# Altium project openmv-ae3.PrjPcb (part 1 of 2)
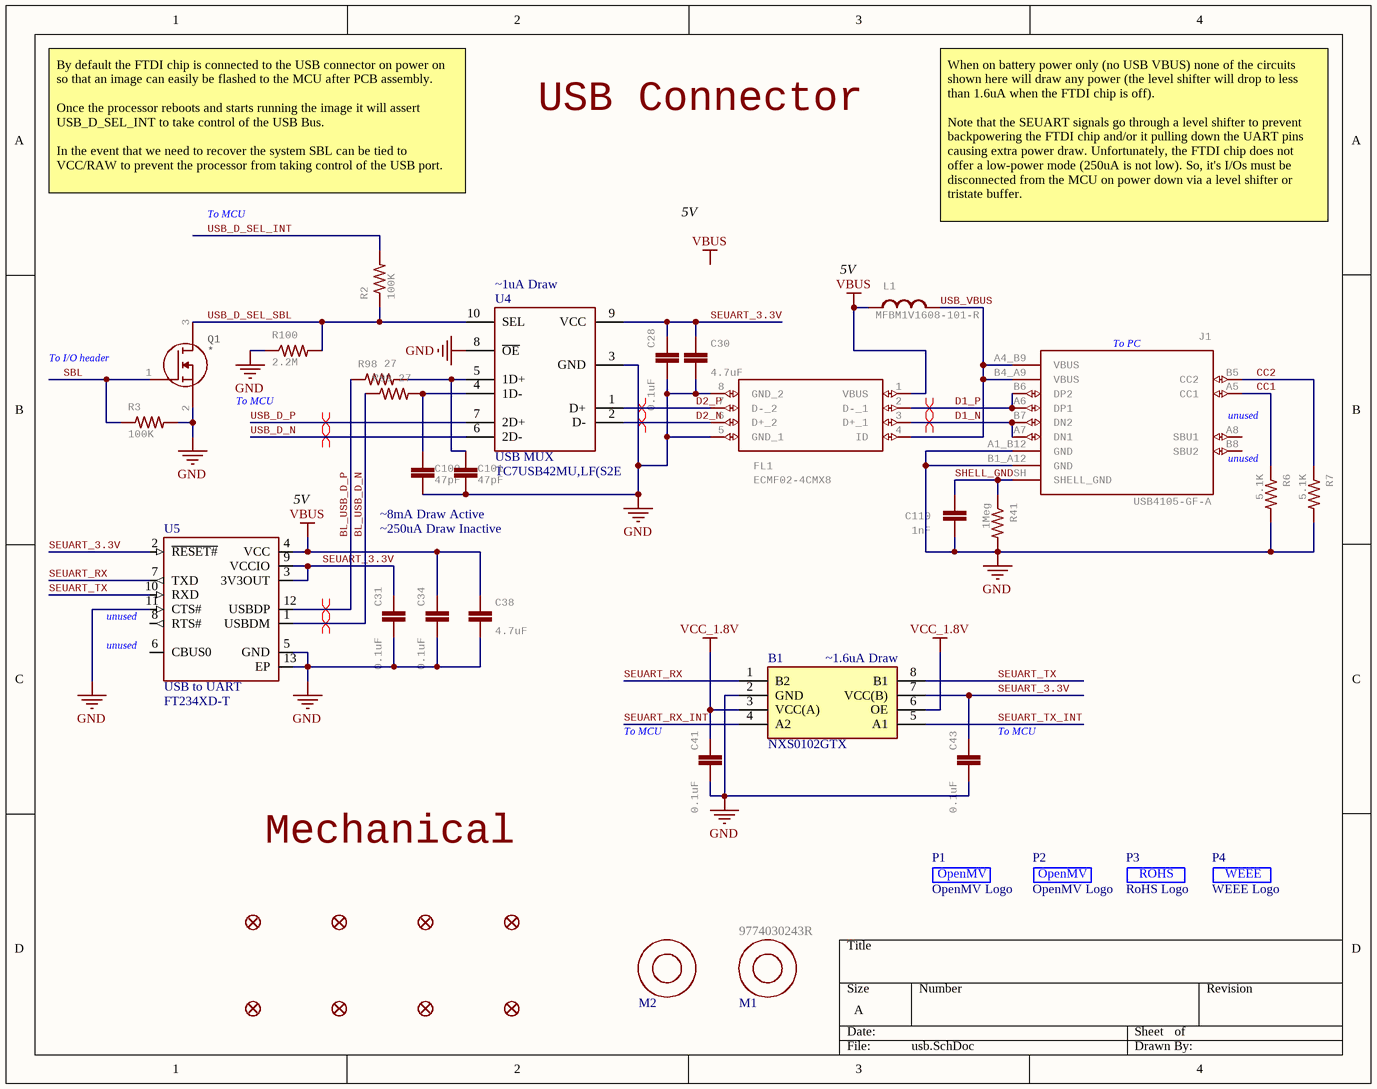
[diagram p0: usb.SchDoc]
16 sheets, 351 parts. Net scope: global (net labels, ports and power ports of the same name join across sheets).
Board file: openmv-ae3.PcbDoc
Sheets:
  usb.SchDoc
  ideal-diode.SchDoc
  battery-charging.SchDoc
  regulators.SchDoc
  prg-flash.SchDoc
  psram.SchDoc
  accelerometer.SchDoc
  sd-card.SchDoc
  sensor-header.SchDoc
  io-headers.SchDoc
  jtag.SchDoc
  display-header.SchDoc
  ethernet.SchDoc
  wifi-bt.SchDoc
  mic.SchDoc
  ae302f.SchDoc

## Sheet usb.SchDoc
size A

### Parts
B1  NXS0102GTX  [NXS0102GTX]
C28  0.1uF  [0402-CAP]
C30  4.7uF  [0402-CAP]
C31  0.1uF  [0402-CAP]
C34  0.1uF  [0402-CAP]
C38  4.7uF  [0402-CAP]
C41  0.1uF  [0402-CAP]
C43  0.1uF  [0402-CAP]
C100  47pF  [C0201]
C101  47pF  [C0201]
C110  1nF  [0402-CAP]
FD1  FIDUCIAL1X2  [FIDUCIAL-1X2]  (value not drawn)
FD2  FIDUCIAL1X2  [FIDUCIAL-1X2]  (value not drawn)
FD3  FIDUCIAL1X2  [FIDUCIAL-1X2]  (value not drawn)
FD4  FIDUCIAL1X2  [FIDUCIAL-1X2]  (value not drawn)
FD5  FIDUCIAL1X2  [FIDUCIAL-1X2]  (value not drawn)
FD6  FIDUCIAL1X2  [FIDUCIAL-1X2]  (value not drawn)
FD7  FIDUCIAL1X2  [FIDUCIAL-1X2]  (value not drawn)
FD8  FIDUCIAL1X2  [FIDUCIAL-1X2]  (value not drawn)
FL1  ECMF02-4CMX8  [ECMF024CMX8]
J1  USB4105-GF-A  [GCT_USB4105-GF-A]
L1  MFBM1V1608-101-R  [0603-RES]
M1  9774030243R  [9774030243R]
M2  9774030243R  [9774030243R]  (value not drawn)
P1  OpenMV Logo  [OMV-LOGO-SMALL]  (no BOM)
P2  OpenMV Logo  [OMV-LOGO-SMALL]  (no BOM)
P3  RoHS Logo  [ROHS]  (no BOM)
P4  WEEE Logo  [WEEE]  (no BOM)
Q1  NMOS  [DFN1006]  (value not drawn)
R2  100K  [R0201]
R3  100K  [R0201]
R6  5.1K  [0402-RES]
R7  5.1K  [0402-RES]
R41  1Meg  [0402-RES]
R98  27  [R0201]
R99  27  [R0201]
R100  2.2M  [R0201]
U4  USB MUX  [TC7USB42MU,LF(S2E]
U5  USB to UART  [SON45P300X300X80-13N]

### Nets
GND: B1.2(GND) C28.2 C30.1 C31.2 C34.2 C38.1 C41.2 C43.2 C100.1 C101.1 C110.2 FL1.5(GND_1) FL1.8(GND_2) J1.A1_B12(GND) J1.B1_A12(GND) Q1.2(S) R3.2 R6.2 R7.2 R41.2 R100.1 U4.3(GND) U4.8(~{OE}) U5.5(GND) U5.11(CTS#) U5.13(EP)
VBUS: C34.1 C38.2 FL1.1(VBUS) L1.1 U5.4(VCC)
VCC_1.8V: B1.3(VCC(A)) B1.6(OE) C41.1
BL_USB_D_N: R99.1 U5.1(USBDM)
BL_USB_D_P: R98.1 U5.12(USBDP)
CC1: J1.A5(CC1) R6.1
CC2: J1.B5(CC2) R7.1
D1_N: FL1.3(D+_1) J1.A7(DN1) J1.B7(DN2)
D1_P: FL1.2(D-_1) J1.A6(DP1) J1.B6(DP2)
D2_N: FL1.6(D+_2) U4.2(D-)
D2_P: FL1.7(D-_2) U4.1(D+)
SBL: Q1.1(G) R3.1
SEUART_3.3V: B1.7(VCC(B)) C28.1 C30.2 C31.1 C43.1 U4.9(VCC) U5.2(~{RESET#}) U5.3(3V3OUT) U5.9(VCCIO)
SEUART_RX: B1.1(B2) U5.7(TXD)
SEUART_RX_INT: B1.4(A2)
SEUART_TX: B1.8(B1) U5.10(RXD)
SEUART_TX_INT: B1.5(A1)
SHELL_GND: C110.1 J1.SH(SHELL_GND) R41.1
USB_D_N: U4.6(2D-)
USB_D_P: U4.7(2D+)
USB_D_SEL_INT: R2.2
USB_D_SEL_SBL: Q1.3(D) R2.1 R100.2 U4.10(SEL)
USB_VBUS: FL1.4(ID) J1.A4_B9(VBUS) J1.B4_A9(VBUS) L1.2
NetC100_2: C100.2 R99.2 U4.4(1D-)
NetC101_2: C101.2 R98.2 U4.5(1D+)

Not connected (* = marked no-connect by the designer): J1 A8(SBU1) B8(SBU2); U5 6(CBUS0) 8(RTS#)

### Layout directives
differential pair: BL_USB_D_N, BL_USB_D_P, D1_N, D1_P, D2_N, D2_P, USB_D_N, USB_D_P

### Notes on the sheet
- USB Connector
- By default the FTDI chip is connected to the USB connector on power on so that an image can easily be flashed to the MCU after PCB assembly.
  Once the processor reboots and starts running the image it will assert USB_D_SEL_INT to take control of the USB Bus.
  In the event that we need to recover the system SBL can be tied to VCC/RAW to prevent the processor from taking control of the USB port.
- To MCU
- 5V
- When on battery power only (no USB VBUS) none of the circuits shown here will draw any power (the level shifter will drop to less than 1.6uA when the FTDI chip is off).
  Note that the SEUART signals go through a level shifter to prevent backpowering the FTDI chip and/or it pulling down the UART pins causing extra power draw. Unfortunately, the FTDI chip does not offer a low-power mode (250uA is not low). So, it's I/Os must be disconnected from the MCU on power down via a level shifter or tristate buffer.
- (near U4) ~1uA Draw
- (near L1) 5V
- To I/O header
- (near J1) To PC
- unused
- (near J1) unused
- (near U5) 5V
- ~250uA Draw Inactive
- ~8mA Draw Active
- (near U5) unused
- (near B1) ~1.6uA Draw
- (near C41) To MCU
- (near C43) To MCU
- Mechanical
- Labels drawn without touching a wire or pin: VBUS
- (in symbol OMV) OpenMV

### Library data of the parts
B1 = NXS0102GTX: Dual supply translating transceiver; open drain; auto direction sensing; Manufacturer_Name: Nexperia; Geometry.Height: 0.5mm; Mouser Part Number: 771-NXS0102GTX; Mouser Price/Stock: https://www.mouser.co.uk/ProductDetail/Nexperia/NXS0102GTX?qs=GBLSl2AkirukzzJX55VgJA%3D%3D; Manufacturer_Part_Number: NXS0102GTX; Datasheet Link: https://assets.nexperia.com/documents/data-sheet/NXS0102.pdf
C28 C31 C34 C41 C43 = C-EUC0201: CAPACITOR, European symbol; MPN: C0402C104Z4VAC; GateName_1: G$1; SymbolName_1: C-EU; POPULARITY: 0; LibraryName: rcl; DeviceSetName: C-EU; SPICEPREFIX: C; Part Number: C0402C104Z4VAC
C30 C38 = CAP0402-CAP: CapacitorStandard 0603 ceramic capacitor, and 0.1" leaded capacitor.; MPN: JMK105BBJ475MV-F; GateName_1: G$1; SymbolName_1: CAP; DeviceName: 0402-CAP; LibraryName: sfe; DeviceSetName: CAP; Part Number: JMK105BBJ475MV-F
C100 C101 = C-EUC0201: CAPACITOR, European symbol; GateName_1: G$1; SymbolName_1: C-EU; POPULARITY: 0; DeviceName: C0201; SPICEPREFIX: C
C110 = CAP0402-CAP: Capacitor; MPN: VJ0402Y102JXACW1BC; GateName_1: G$1; SymbolName_1: CAP; DeviceName: 0402-CAP; LibraryName: sfe; DeviceSetName: CAP; Part Number: VJ0402Y102JXACW1BC
FD1-FD8 = FIDUCIAL1X2: Fiducial Alignment Points    Point-of-reference for pick-and-place machines and other optical instruments.; GateName_1: G$1; DeviceName: 1X2; SymbolName_1: FIDUCIAL; LibraryName: SparkFun-Aesthetics; DeviceSetName: FIDUCIAL
FL1 = ECMF02-4CMX8: Common Mode Filter & ESD Prot. USB uQFN8 STMicroelectronics ECMF02 Series, Signal Filter uQFN SMD, Flat Contact Termination, 2.6 x 1.3 x 0.6mm   Source:  Datasheet; GateName_1: G$1; SymbolName_1: ECMF02-4CMX8; LibraryName: ECMF02-4CMX8; DeviceSetName: ECMF02-4CMX8; HEIGHT: mm; MANUFACTURER_NAME: STMicroelectronics; MANUFACTURER_PART_NUMBER: ECMF02-4CMX8; MOUSER_PART_NUMBER: 511-ECMF02-4CMX8; MOUSER_PRICE-STOCK: https://www.mouser.co.uk/ProductDetail/STMicroelectronics/ECMF02-4CMX8?qs=xYt8xtm2zhmK7GoDlDZR3A%3D%3D; MPN: ECMF02-4CMX8; Part Number: ECMF02-4CMX8
J1 = USB4105-GF-A: USB-C (USB TYPE-C) USB 2.0 Receptacle Connector 24 (16+8 Dummy) Position Surface Mount, Right Angle; Through Hole  Check availability; GateName_1: G$1; MF: GCT; SymbolName_1: USB4105-GF-A; LibraryName: USB4105-GF-A; DeviceSetName: USB4105-GF-A; AVAILABILITY: In Stock; MP: USB4105-GF-A; MPN: USB4105-GF-A; PACKAGE: None; PRICE: None; PURCHASE-URL: https://pricing.snapeda.com/search/part/USB4105-GF-A/?ref=eda; Part Number: USB4105-GF-A
L1 = INDUCTOR: InductorsBasic Inductor/Choke - 0603 and 1206. Footprints are not proven and vary greatly between part numbers.; GateName_1: G$1; MPN: MFBM1V1608-101-R; Part Number: MFBM1V1608-101-R
M1 M2 = 9774030243R: M2 3mm Standoff; GateName_1: G$1; SymbolName_1: 9774030243R; LibraryName: 9774030243R; DeviceSetName: 9774030243R; MPN: 9774030243R; Part Number: 9774030243R
P1 P2 = OMV
P3 = ROHS
P4 = WEEE
R2 R3 R98-R100 = RESISTOR0402-RES: GateName_1: G$1; SymbolName_1: RESISTOR; LibraryName: sfe; DeviceSetName: RESISTOR
  R2 R3 R100: DeviceName: 0402-RES
R6 R7 = RESISTOR0402-RES: ResistorBasic schematic elements and footprints for 0603, 1206, and PTH resistors.; MPN: RC0402JR-075K1L; GateName_1: G$1; SymbolName_1: RESISTOR; DeviceName: 0402-RES; LibraryName: sfe; DeviceSetName: RESISTOR; Part Number: RC0402JR-075K1L
R41 = RESISTOR0402-RES: Resistor; MPN: CRCW04021M00FKEDC; GateName_1: G$1; SymbolName_1: RESISTOR; DeviceName: 0402-RES; LibraryName: sfe; DeviceSetName: RESISTOR; Part Number: CRCW04021M00FKEDC
U4 = TC7USB42MU,LF(S2E: MF: Toshiba; MPN: TC7USB42MU,LF(S2E
U5 = FT234XD-T: USB Bridge, USB to UART USB 2.0 UART Interface 12-DFN _3x3_; MF: FTDI,; Part Number: FT234XD-T; MPN: FT234XD-T
Q1 = NMOS: MPN: *

## Sheet ideal-diode.SchDoc
size A
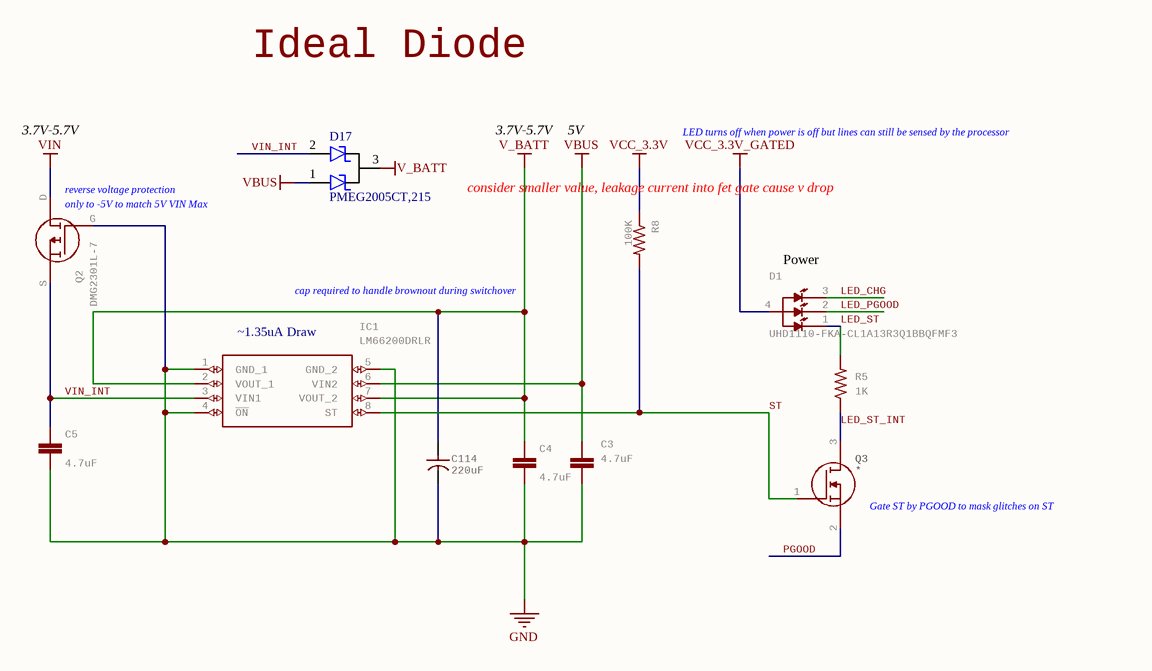
[diagram p1: ideal-diode.SchDoc]

### Parts
C3  4.7uF  [0402-CAP]
C4  4.7uF  [0402-CAP]
C5  4.7uF  [0402-CAP]
C114  220uF  [CAP-TANT-1411]
D1  UHD1110-FKA-CL1A13R3Q1BBQFMF3  [LED_UHD1110-FKA-CL1A13R3Q1BBQFMF3]
D17  MPN: PMEG2005CT,215  [SOT-23-3]  (hidden comment: Dual Schottky)
IC1  LM66200DRLR  [SOTFL50P160X60-8N]
Q2  DMG2301L-7  [SOT-23-3-FET]
Q3  NMOS  [DFN1006]  (value not drawn)
R5  1K  [r0201]
R8  100K  [r0201]

### Nets
GND: C3.1 C4.1 C5.1 C114.2 IC1.1(GND_1) IC1.4(~{ON}) IC1.5(GND_2) Q2.G
V_BATT: C4.2 C114.1 D17.3 IC1.2(VOUT_1) IC1.7(VOUT_2)
VBUS: C3.2 D17.1 IC1.6(VIN2)
VCC_3.3V: R8.1
VCC_3.3V_GATED: D1.4(ANODE)
VIN: Q2.D
LED_CHG: D1.3(RED)
LED_PGOOD: D1.2(GREEN)
LED_ST: D1.1(BLUE) R5.2
LED_ST_INT: Q3.3(D) R5.1
PGOOD: Q3.2(S)
ST: IC1.8(ST) Q3.1(G) R8.2
VIN_INT: C5.2 D17.2 IC1.3(VIN1) Q2.S

### Notes on the sheet
- Ideal Diode
- 3.7V-5.7V
- 5V
- LED turns off when power is off but lines can still be sensed by the processor
- (near Q2) reverse voltage protection
- (near Q2) only to -5V to match 5V VIN Max
- (near R8) consider smaller value, leakage current into fet gate cause v drop
- (near D1) Power
- (near IC1) ~1.35uA Draw
- cap required to handle brownout during switchover
- (near Q3) Gate ST by PGOOD to mask glitches on ST

### Library data of the parts
C3-C5 = CAP0402-CAP: as C30 on sheet usb; DeviceName: 0402-CAP; LibraryName: sfe; DeviceSetName: CAP; Part Number: JMK105BBJ475MV-F
C114 = CAP_POL: MANUFACTURER P/N: F930J227MBA; Part Number: F930J227MBA; DISTRIBUTOR: *; DISTRIBUTOR P/N: *; Value: 220uF; Parameter 1: *; MPN: F930J227MBA
D1 = UHD1110-FKA-CL1A13R3Q1BBQFMF3: LED RGB SMD, SIZE 1 X 1 mm Check availability; GateName_1: G$1; MF: Cree Inc.; SymbolName_1: UHD1110-FKA-CL1A13R3Q1BBQFMF3; LibraryName: UHD1110-FKA-CL1A13R3Q1BBQFMF3; DeviceSetName: UHD1110-FKA-CL1A13R3Q1BBQFMF3; AVAILABILITY: In Stock; MP: UHD1110-FKA-CL1A13R3Q1BBQFMF3; MPN: UHD1110-FKA-CL1A13r3q1BBQFMF3; PACKAGE: 0404 Cree Inc.; PRICE: None; PURCHASE-URL: https://pricing.snapeda.com/search/part/UHD1110-FKA-CL1A13R3Q1BBQFMF3/?ref=eda; Part Number: UHD1110-FKA-CL1A13r3q1BBQFMF3
D17 = Dual Schottky: MANUFACTURER: Nexperia; Value: ?V; Part Number: PMEG2005CT,215
IC1 = LM66200DRLR: 1.6-V to 5.5-V, 40-m, 2.5-A, low-IQ, dual ideal diode   Source:  Datasheet; MANUFACTURER_NAME: Texas Instruments; GateName_1: G$1; SymbolName_1: LM66200DRLR; LibraryName: LM66200DRLR; DeviceSetName: LM66200DRLR; HEIGHT: 0.6mm; MANUFACTURER_PART_NUMBER: LM66200DRLR; MOUSER_PART_NUMBER: 595-LM66200DRLR; MOUSER_PRICE-STOCK: https://www.mouser.co.uk/ProductDetail/Texas-Instruments/LM66200DRLR?qs=Rp5uXu7WBW90hnpZAkIOdQ%3D%3D; MPN: LM66200DRLR; Part Number: LM66200DRLR
Q2 = DMG2301L-7: GateName_1: G$1; HEIGHT: 1.1mm; MPN: DMG2301L-7; Part Number: DMG2301L-7
R5 = RESISTOR0402-RES: ResistorBasic schematic elements and footprints for 0603, 1206, and PTH resistors.; GateName_1: G$1; SymbolName_1: RESISTOR; LibraryName: sfe; DeviceSetName: RESISTOR
R8 = RESISTOR0402-RES: GateName_1: G$1; SymbolName_1: RESISTOR; LibraryName: sfe; DeviceSetName: RESISTOR
Q3 = NMOS: MPN: *

## Sheet battery-charging.SchDoc
size A
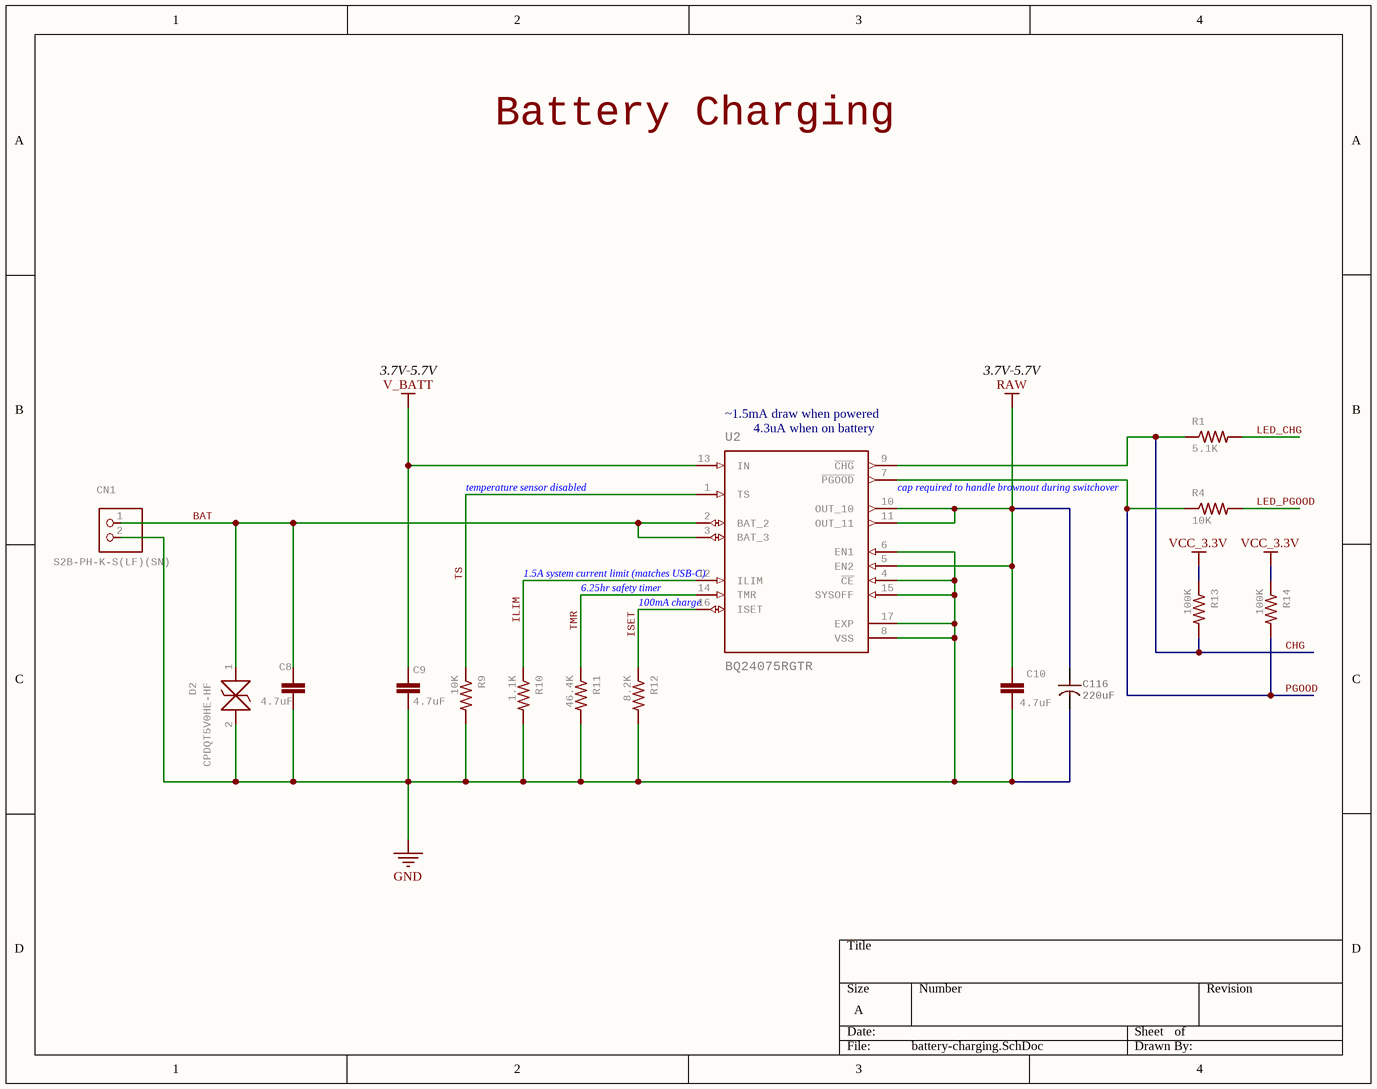
[diagram p2: battery-charging.SchDoc]

### Parts
C8  4.7uF  [0402-CAP]
C9  4.7uF  [0402-CAP]
C10  4.7uF  [0402-CAP]
C116  220uF  [CAP-TANT-1411]
CN1  S2B-PH-K-S(LF)(SN)  [JST-PH-2-THM-RA]
D2  CPDQT5V0HE-HF  [CPDQT5V0HEHF]
R1  5.1K  [R0201]
R4  10K  [R0201]
R9  10K  [0402-RES]
R10  1.1K  [0402-RES]
R11  46.4K  [0402-RES]
R12  8.2K  [0402-RES]
R13  100K  [R0201]
R14  100K  [R0201]
U2  BQ24075RGTR  [QFN50P300X300X100-17N]

### Nets
GND: C8.1 C9.1 C10.1 C116.2 CN1.2 D2.2 R9.2 R10.2 R11.2 R12.2 U2.4(~{CE}) U2.6(EN1) U2.8(VSS) U2.15(SYSOFF) U2.17(EXP)
RAW: C10.2 C116.1 U2.5(EN2) U2.10(OUT_10) U2.11(OUT_11)
V_BATT: C9.2 U2.13(IN)
VCC_3.3V: R13.1 R14.1
BAT: C8.2 CN1.1 D2.1 U2.2(BAT_2) U2.3(BAT_3)
CHG: R1.1 R13.2 U2.9(~{CHG})
ILIM: R10.1 U2.12(ILIM)
ISET: R12.1 U2.16(ISET)
LED_CHG: R1.2
LED_PGOOD: R4.2
PGOOD: R4.1 R14.2 U2.7(~{PGOOD})
TMR: R11.1 U2.14(TMR)
TS: R9.1 U2.1(TS)

### Notes on the sheet
- Battery Charging
- 3.7V-5.7V
- (near U2) ~1.5mA draw when powered
- (near U2) 4.3uA when on battery
- temperature sensor disabled
- (near U2) cap required to handle brownout during switchover
- (near U2) 1.5A system current limit (matches USB-C)
- (near U2) 6.25hr safety timer
- (near U2) 100mA charge

### Library data of the parts
C8-C10 = CAP0402-CAP: as C30 on sheet usb; DeviceName: 0402-CAP; LibraryName: sfe; DeviceSetName: CAP; Part Number: JMK105BBJ475MV-F
C116 = CAP_POL: MANUFACTURER P/N: F930J227MBA; Part Number: F930J227MBA; DISTRIBUTOR: *; DISTRIBUTOR P/N: *; Value: 220uF; Parameter 1: *; MPN: F930J227MBA
CN1 = JST_2PIN-THM-RA: JST 2-Pin Connectors of various flavors SMT-RA (S2B-PH-SM4) 4UConnector #17311  SMT  (B2B-PH-SM4)  THM-RA (S2B-PH)  THM  (B2B-PH); GateName_1: G$1; SymbolName_1: PINHD2; DeviceName: -THM-RA; LibraryName: adafruit-updated; DeviceSetName: JST_2PIN; MPN: S2B-PH-K-S(LF)(SN); Part Number: S2B-PH-K-S(LF)(SN)
D2 = CPDQT5V0HE-HF: ESD Suppressors / TVS Diodes DIODE ESD 5VWM 65W 0402/SOD-923F   Source:  Datasheet; MANUFACTURER_NAME: Comchip Technology; GateName_1: G$1; SymbolName_1: CPDQT5V0HE-HF; LibraryName: CPDQT5V0HE-HF; DeviceSetName: CPDQT5V0HE-HF; HEIGHT: 0.42mm; MANUFACTURER_PART_NUMBER: CPDQT5V0HE-HF; MOUSER_PART_NUMBER: MOUSER_PART_NUMBER; MOUSER_PRICE-STOCK: MOUSER_PRICE-STOCK; MPN: CPDQT5V0HE-HF; Part Number: CPDQT5V0HE-HF
R1 R4 R13 R14 = RESISTOR0402-RES: GateName_1: G$1; SymbolName_1: RESISTOR; LibraryName: sfe
  R1 R13 R14: DeviceSetName: RESISTOR
R9 = RESISTOR0402-RES: ResistorBasic schematic elements and footprints for 0603, 1206, and PTH resistors.; MPN: AC0402FR-1310KL; GateName_1: G$1; SymbolName_1: RESISTOR; DeviceName: 0402-RES; LibraryName: sfe; DeviceSetName: RESISTOR; Part Number: AC0402FR-1310KL
R10 = RESISTOR0402-RES: ResistorBasic schematic elements and footprints for 0603, 1206, and PTH resistors.; MPN: RC0402JR-071K1; GateName_1: G$1; SymbolName_1: RESISTOR; DeviceName: 0402-RES; LibraryName: sfe; DeviceSetName: RESISTOR; Part Number: RC0402JR-071K1
R11 = RESISTOR0402-RES: ResistorBasic schematic elements and footprints for 0603, 1206, and PTH resistors.; MPN: WR04X4642FTL; GateName_1: G$1; SymbolName_1: RESISTOR; DeviceName: 0402-RES; LibraryName: sfe; DeviceSetName: RESISTOR; Part Number: WR04X4642FTL
R12 = RESISTOR0402-RES: ResistorBasic schematic elements and footprints for 0603, 1206, and PTH resistors.; MPN: CR0402-FX-8201GLF; GateName_1: G$1; SymbolName_1: RESISTOR; DeviceName: 0402-RES; LibraryName: sfe; DeviceSetName: RESISTOR; Part Number: CR0402-FX-8201GLF
U2 = BQ24075RGTR: Standalone 1-cell 1.5-A linear charger, Power Path, 4.2-V VBAT and 5.5-V VOUT 16-VQFN -40 to 85  Check availability; GateName_1: G$1; MF: Texas Instruments; SymbolName_1: BQ24075RGTR; LibraryName: BQ24075RGTR; DeviceSetName: BQ24075RGTR; AVAILABILITY: In Stock; MP: BQ24075RGTR; MPN: BQ24075RGTR; PACKAGE: VQFN-16 Texas Instruments; PRICE: None; PURCHASE-URL: https://pricing.snapeda.com/search/part/BQ24075RGTR/?ref=eda; Part Number: BQ24075RGTR

## Sheet regulators.SchDoc
size B
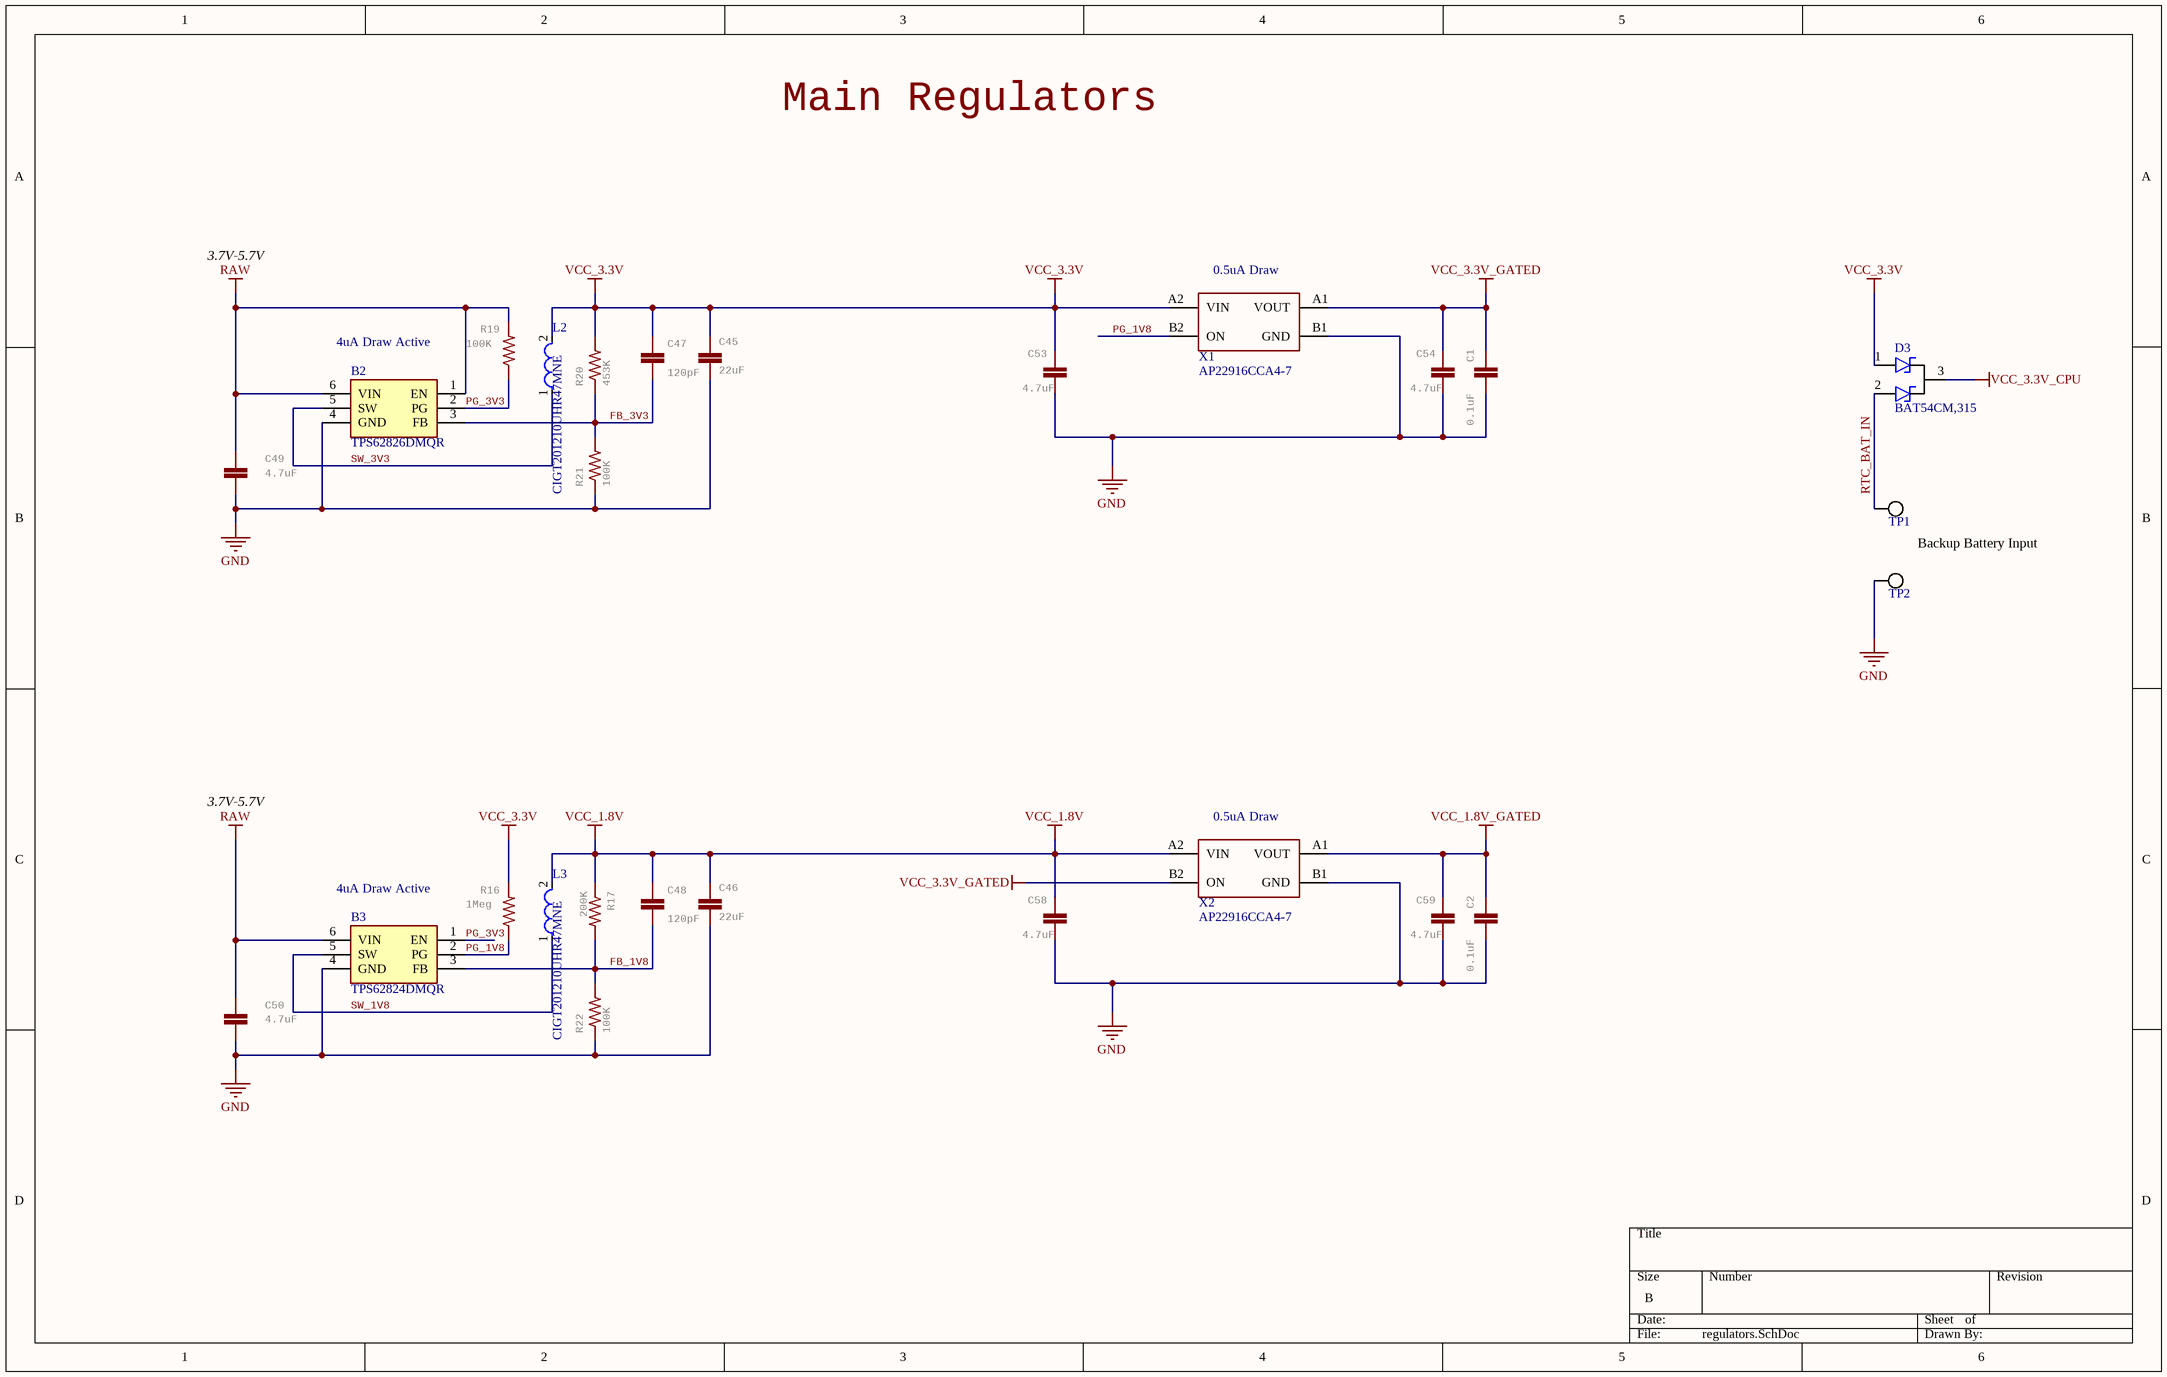
[diagram p3: regulators.SchDoc]

### Parts
B2  TPS62826DMQR  [TPS62826ADMQR]
B3  TPS62824DMQR  [TPS62826ADMQR]
C1  0.1uF  [0402-CAP]
C2  0.1uF  [0402-CAP]
C45  22uF  [0805]
C46  22uF  [0805]
C47  120pF  [C0201]
C48  120pF  [C0201]
C49  4.7uF  [0402-CAP]
C50  4.7uF  [0402-CAP]
C53  4.7uF  [0402-CAP]
C54  4.7uF  [0402-CAP]
C58  4.7uF  [0402-CAP]
C59  4.7uF  [0402-CAP]
D3  MPN: BAT54CM,315  [DFN1006]  (hidden comment: Dual Schottky)
L2  CIGT201210UHR47MNE  [0805]
L3  CIGT201210UHR47MNE  [0805]
R16  1Meg  [R0201]
R17  200K  [R0201]
R19  100K  [R0201]
R20  453K  [R0201]
R21  100K  [R0201]
R22  100K  [R0201]
TP1  TP  [TP_1p8]  (value not drawn)  (no BOM)
TP2  TP  [TP_1p8]  (value not drawn)  (no BOM)
X1  PMOS Load Switch  [AP22916CCA4-7]  (value not drawn)
X2  PMOS Load Switch  [AP22916CCA4-7]  (value not drawn)

### Nets
GND: B2.4(GND) B3.4(GND) C1.2 C2.2 C45.2 C46.2 C49.1 C50.1 C53.2 C54.2 C58.2 C59.2 R21.1 R22.1 TP2.1 X1.B1(GND) X2.B1(GND)
RAW: B2.1(EN) B2.6(VIN) B3.6(VIN) C49.2 C50.2 R19.2
VCC_1.8V: C46.1 C48.2 C58.1 L3.2 R17.1 X2.A2(VIN)
VCC_1.8V_GATED: C2.1 C59.1 X2.A1(VOUT)
VCC_3.3V: C45.1 C47.2 C53.1 D3.1 L2.2 R16.2 R20.2 X1.A2(VIN)
VCC_3.3V_CPU: D3.3
VCC_3.3V_GATED: C1.1 C54.1 X1.A1(VOUT) X2.B2(ON)
FB_1V8: B3.3(FB) C48.1 R17.2 R22.2
FB_3V3: B2.3(FB) C47.1 R20.1 R21.2
PG_1V8: B3.2(PG) R16.1 X1.B2(ON)
PG_3V3: B2.2(PG) B3.1(EN) R19.1
RTC_BAT_IN: D3.2 TP1.1
SW_1V8: B3.5(SW) L3.1
SW_3V3: B2.5(SW) L2.1

### Notes on the sheet
- Main Regulators
- 3.7V-5.7V
- (near X1) 0.5uA Draw
- (near B2) 4uA Draw Active
- Backup Battery Input
- (near X2) 0.5uA Draw
- (near B3) 4uA Draw Active

### Library data of the parts
B2 = TPS62826ADMQR: Switching Voltage Regulators 2.4-V to 5.5-V input, 3-A step-down converter with in 1.5-mm 1.5-mm QFN package; Manufacturer_Name: Texas Instruments; Geometry.Height: 1mm; Mouser Part Number: 595-TPS62826DMQR; Mouser Price/Stock: https://www.mouser.co.uk/ProductDetail/Texas-Instruments/TPS62826ADMQR?qs=KUoIvG%2F9Ila3pPUbedlDEw%3D%3D; Manufacturer_Part_Number: TPS62826DMQR; Datasheet Link: https://www.ti.com/lit/ds/symlink/tps62825a.pdf?ts=1608196934558&ref_url=https%253A%252F%252Fwww.ti.com%252Fstore%252Fti%252Fen%252Fp%252Fproduct%252F%253Fp%253DTPS62825ADMQR%2526keyMatch%253DTPS62825ADMQR%2526tisearch%253DSearch-EN-everything%2526usecase; MPN: TPS62826DMQR; Part Number: TPS62826DMQR
B3 = TPS62826ADMQR: Switching Voltage Regulators 2.4-V to 5.5-V input, 1-A step-down converter in 1.5-mm 1.5-mm QFN package; Manufacturer_Name: Texas Instruments; Geometry.Height: 1mm; Mouser Part Number: 595-TPS62824DMQR; Mouser Price/Stock: https://www.mouser.co.uk/ProductDetail/Texas-Instruments/TPS62826ADMQR?qs=KUoIvG%2F9Ila3pPUbedlDEw%3D%3D; Manufacturer_Part_Number: TPS62824DMQR; Datasheet Link: https://www.ti.com/lit/ds/symlink/tps62825a.pdf?ts=1608196934558&ref_url=https%253A%252F%252Fwww.ti.com%252Fstore%252Fti%252Fen%252Fp%252Fproduct%252F%253Fp%253DTPS62825ADMQR%2526keyMatch%253DTPS62825ADMQR%2526tisearch%253DSearch-EN-everything%2526usecase; MPN: TPS62824DMQR; Part Number: TPS62824DMQR
C1 C2 = C-EUC0201: as C28 on sheet usb; LibraryName: rcl; DeviceSetName: C-EU; SPICEPREFIX: C; Part Number: C0402C104Z4VAC
C45 C46 = 22UF-0805-6.3V-20%: 22ÂµF ceramic capacitors    A capacitor is a passive two-terminal electrical component used to store electrical energy temporarily in an electric field.; MPN: CL21A226MQQNNNE; GateName_1: G$1; SymbolName_1: CAP; PROD_ID: CAP-08402; DeviceName: -0805-6.3V-20%; LibraryName: SparkFun-Capacitors; DeviceSetName: 22UF; Part Number: CL21A226MQQNNNE
C47 C48 = CAP0402-CAP: GateName_1: G$1; SymbolName_1: CAP; LibraryName: sfe; DeviceSetName: CAP
C49 C50 C53 C54 C58 C59 = CAP0402-CAP: as C30 on sheet usb; DeviceName: 0402-CAP; LibraryName: sfe; DeviceSetName: CAP; Part Number: JMK105BBJ475MV-F
D3 = Dual Schottky: Part Number: BAT54CLT3G; Value: ?V
L2 L3 = CMP-00002-1: Power Inductor : LxW size(mm) 2012 Thickness1 Inductance (uH) 20%: 0.47; Current Rating: 3.6A; Shielding: Unshielded; Test Frequency: 1MHz; DC Resistance (DCR): 31mR; Saturation Current: 5.4A; Core Material: Metal,Composite; Value: 470nH; Tolerance: 20%; Packaging: Cut Tape; Case Code (Imperial): 0805; Case/Package: 0805; RoHS Compliant: Yes; Max Operating Temperature: 125°C; Series: CIGT; Min Operating Temperature: -40°C; Mounting Technology: Surface Mount; Case Code (Metric): 2012; MPN: CIGT201210UHR47MNE; Part Number: CIGT201210UHR47MNE
R16 R17 R19-R22 = RESISTOR0402-RES: GateName_1: G$1; SymbolName_1: RESISTOR; LibraryName: sfe; DeviceSetName: RESISTOR
X1 X2 = AP22916CCA4-7: MF: Diodes Inc; MPN: AP22916CCA4-7

## Sheet prg-flash.SchDoc
size A
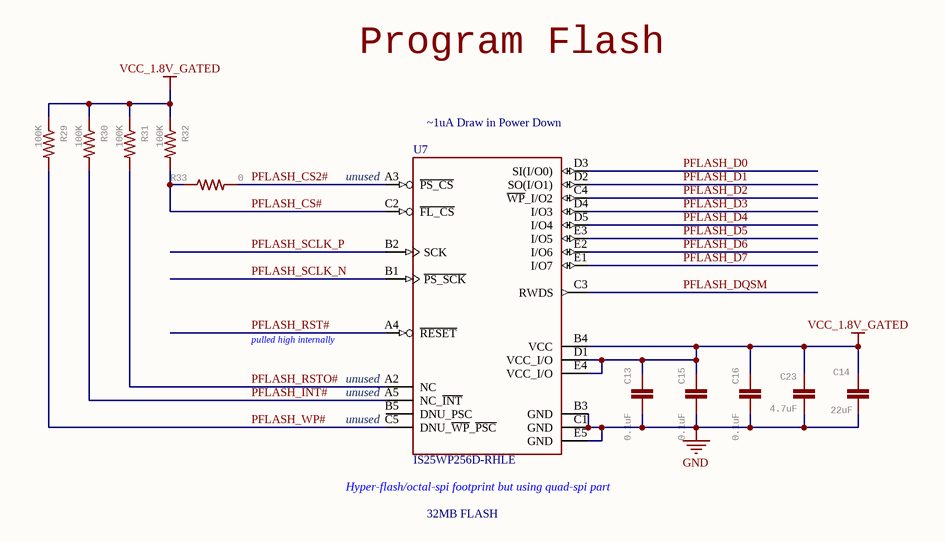
[diagram p4: prg-flash.SchDoc]

### Parts
C13  0.1uF  [0402-CAP]
C14  22uF  [0805]
C15  0.1uF  [0402-CAP]
C16  0.1uF  [0402-CAP]
C23  4.7uF  [0402-CAP]
R29  100K  [0402-RES]
R30  100K  [0402-RES]
R31  100K  [0402-RES]
R32  100K  [0402-RES]
R33  0  [0402-RES]
U7  IS25WP256D-RHLE  [24-TBGA]

### Nets
GND: C13.2 C14.1 C15.2 C16.2 C23.1 U7.B3(GND) U7.C1(GND) U7.E5(GND)
VCC_1.8V_GATED: C13.1 C14.2 C15.1 C16.1 C23.2 R29.1 R30.1 R31.1 R32.1 U7.B4(VCC) U7.D1(VCC_I/O) U7.E4(VCC_I/O)
PFLASH_CS2#: R33.2 U7.A3(~{PS_CS})
PFLASH_CS#: R32.2 R33.1 U7.C2(~{FL_CS})
PFLASH_D0: U7.D3(SI(I/O0))
PFLASH_D1: U7.D2(SO(I/O1))
PFLASH_D2: U7.C4(~{WP}_I/O2)
PFLASH_D3: U7.D4(I/O3)
PFLASH_D4: U7.D5(I/O4)
PFLASH_D5: U7.E3(I/O5)
PFLASH_D6: U7.E2(I/O6)
PFLASH_D7: U7.E1(I/O7)
PFLASH_DQSM: U7.C3(RWDS)
PFLASH_INT#: R30.2 U7.A5(NC_~{INT})
PFLASH_RST#: U7.A4(~{RESET})
PFLASH_RSTO#: R31.2 U7.A2(NC)
PFLASH_SCLK_N: U7.B1(~{PS_SCK})
PFLASH_SCLK_P: U7.B2(SCK)
PFLASH_WP#: R29.2 U7.C5(DNU_~{WP}_~{PSC})

Not connected (* = marked no-connect by the designer): U7 B5(DNU_PSC)

### Notes on the sheet
- Program Flash
- (near U7) ~1uA Draw in Power Down
- (near U7) unused
- pulled high internally
- (near U7) Hyper-flash/octal-spi footprint but using quad-spi part
- 32MB FLASH

### Library data of the parts
C13 C15 C16 = C-EUC0201: as C28 on sheet usb; LibraryName: rcl; DeviceSetName: C-EU; SPICEPREFIX: C; Part Number: C0402C104Z4VAC
C14 = 22UF-0805-6.3V-20%: as C45 on sheet regulators; DeviceName: -0805-6.3V-20%; LibraryName: SparkFun-Capacitors; DeviceSetName: 22UF; Part Number: CL21A226MQQNNNE
C23 = CAP0402-CAP: as C30 on sheet usb; DeviceName: 0402-CAP; LibraryName: sfe; DeviceSetName: CAP; Part Number: JMK105BBJ475MV-F
R29-R32 = RESISTOR0402-RES: ResistorBasic schematic elements and footprints for 0603, 1206, and PTH resistors.; MPN: AC0402FR-07100KL; GateName_1: G$1; SymbolName_1: RESISTOR; DeviceName: 0402-RES; LibraryName: sfe; DeviceSetName: RESISTOR; Part Number: AC0402FR-07100KL
R33 = RESISTOR0402-RES: ResistorBasic schematic elements and footprints for 0603, 1206, and PTH resistors.; MPN: RC0402JR-070R; GateName_1: G$1; SymbolName_1: RESISTOR; DeviceName: 0402-RES; LibraryName: sfe; DeviceSetName: RESISTOR; Part Number: RC0402JR-070R
U7 = IS25WX256-JHLE: IC, Flash,32MB x 8, Octal SPI, Ind Temp, 1.8V,24-BGA; MF: ISSI; Part Number: IS25WP256D-RHLE; MPN: IS25WP256D-RHLE

## Sheet psram.SchDoc
size A
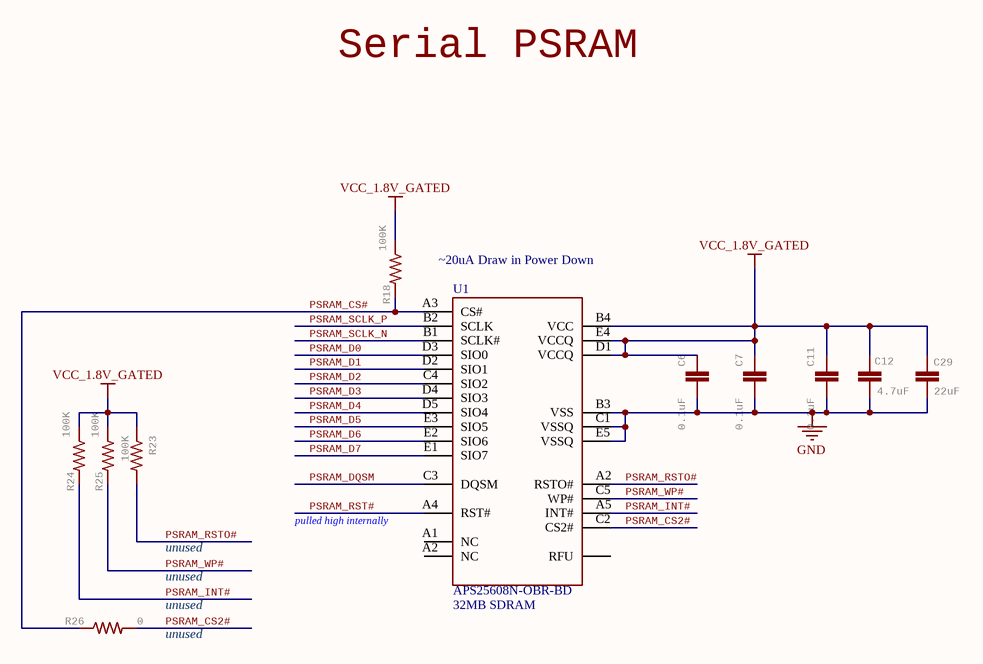
[diagram p5: psram.SchDoc]

### Parts
C6  0.1uF  [0402-CAP]
C7  0.1uF  [0402-CAP]
C11  0.1uF  [0402-CAP]
C12  4.7uF  [0402-CAP]
C29  22uF  [0805]
R18  100K  [0402-RES]
R23  100K  [0402-RES]
R24  100K  [0402-RES]
R25  100K  [0402-RES]
R26  0  [0402-RES]
U1  APS25608N-OBR-BD  [24-TBGA]

### Nets
GND: C6.2 C7.2 C11.2 C12.1 C29.1 U1.B3(VSS) U1.C1(VSSQ) U1.E5(VSSQ)
VCC_1.8V_GATED: C6.1 C7.1 C11.1 C12.2 C29.2 R18.1 R23.1 R24.1 R25.1 U1.B4(VCC) U1.D1(VCCQ) U1.E4(VCCQ)
PSRAM_CS2#: R26.2 U1.C2(CS2#)
PSRAM_CS#: R18.2 R26.1 U1.A3(CS#)
PSRAM_D0: U1.D3(SIO0)
PSRAM_D1: U1.D2(SIO1)
PSRAM_D2: U1.C4(SIO2)
PSRAM_D3: U1.D4(SIO3)
PSRAM_D4: U1.D5(SIO4)
PSRAM_D5: U1.E3(SIO5)
PSRAM_D6: U1.E2(SIO6)
PSRAM_D7: U1.E1(SIO7)
PSRAM_DQSM: U1.C3(DQSM)
PSRAM_INT#: R24.2 U1.A5(INT#)
PSRAM_RST#: U1.A4(RST#)
PSRAM_RSTO#: R23.2 U1.A2(NC)
PSRAM_SCLK_N: U1.B1(SCLK#)
PSRAM_SCLK_P: U1.B2(SCLK)
PSRAM_WP#: R25.2 U1.C5(RFU)

Not connected (* = marked no-connect by the designer): U1 A1(NC)

### Notes on the sheet
- Serial PSRAM
- ~20uA Draw in Power Down
- unused
- (near U1) pulled high internally
- (near R26) unused
- (near U1) 32MB SDRAM

### Library data of the parts
C6 C7 C11 = C-EUC0201: as C28 on sheet usb; LibraryName: rcl; DeviceSetName: C-EU; SPICEPREFIX: C; Part Number: C0402C104Z4VAC
C12 = CAP0402-CAP: as C30 on sheet usb; DeviceName: 0402-CAP; LibraryName: sfe; DeviceSetName: CAP; Part Number: JMK105BBJ475MV-F
C29 = 22UF-0805-6.3V-20%: as C45 on sheet regulators; DeviceName: -0805-6.3V-20%; LibraryName: SparkFun-Capacitors; DeviceSetName: 22UF; Part Number: CL21A226MQQNNNE
R18 R23-R25 = RESISTOR0402-RES: as R29 on sheet prg-flash; SymbolName_1: RESISTOR; DeviceName: 0402-RES; LibraryName: sfe; DeviceSetName: RESISTOR; Part Number: AC0402FR-07100KL
R26 = RESISTOR0402-RES: as R33 on sheet prg-flash; SymbolName_1: RESISTOR; DeviceName: 0402-RES; LibraryName: sfe; DeviceSetName: RESISTOR; Part Number: RC0402JR-070R
U1 = IS66WVO32M8DALL-200BLI-TR: MF: ISSI; MPN: APS25608N-OBR-BD; Part Number: APS25608N-OBR-BD

## Sheet accelerometer.SchDoc
size A
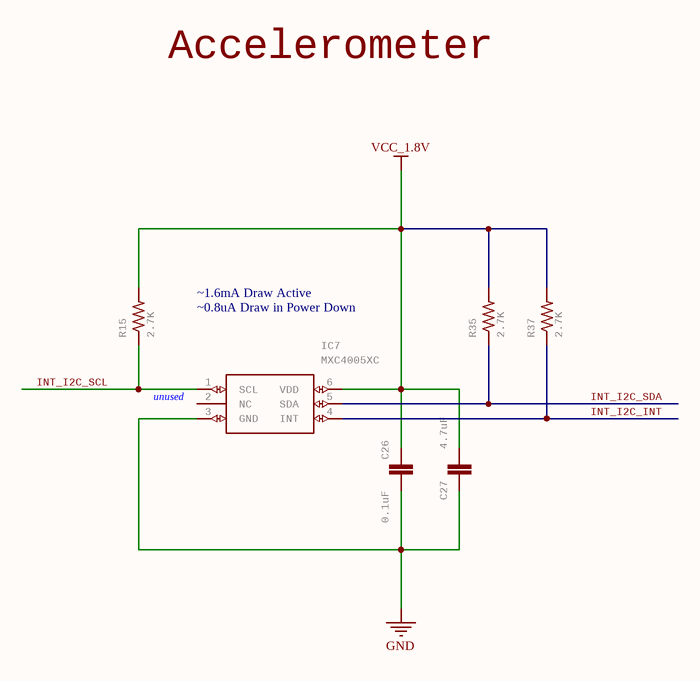
[diagram p6: accelerometer.SchDoc]

### Parts
C26  0.1uF  [0402-CAP]
C27  4.7uF  [0402-CAP]
IC7  MXC4005XC  [MXC4005XC]
R15  2.7K  [R0201]
R35  2.7K  [R0201]
R37  2.7K  [R0201]

### Nets
GND: C26.2 C27.1 IC7.3(GND)
VCC_1.8V: C26.1 C27.2 IC7.6(VDD) R15.2 R35.2 R37.2
INT_I2C_INT: IC7.4(INT) R37.1
INT_I2C_SCL: IC7.1(SCL) R15.1
INT_I2C_SDA: IC7.5(SDA) R35.1

Not connected (* = marked no-connect by the designer): IC7 2(NC)

### Notes on the sheet
- Accelerometer
- ~0.8uA Draw in Power Down
- ~1.6mA Draw Active
- unused

### Library data of the parts
C26 = C-EUC0201: as C28 on sheet usb; LibraryName: rcl; DeviceSetName: C-EU; SPICEPREFIX: C; Part Number: C0402C104Z4VAC
C27 = CAP0402-CAP: as C30 on sheet usb; DeviceName: 0402-CAP; LibraryName: sfe; DeviceSetName: CAP; Part Number: JMK105BBJ475MV-F
IC7 = MXC4005XC: Accelerometers Monolithic and Wafer Level Packaged Three-Axis Accelerometer   Source:  Datasheet; MANUFACTURER_NAME: MEMSIC; GateName_1: G$1; SymbolName_1: MXC4005XC; LibraryName: MXC4005XC; DeviceSetName: MXC4005XC; HEIGHT: 0.885mm; MANUFACTURER_PART_NUMBER: MXC4005XC; MOUSER_PART_NUMBER: 438-MXC4005XC; MOUSER_PRICE-STOCK: https://www.mouser.co.uk/ProductDetail/MEMSIC/MXC4005XC?qs=RcG8xmE7yp3iyYgWLmAtUw%3D%3D; MPN: MXC4005XC; Part Number: MXC4005XC
R15 R35 R37 = RESISTOR0402-RES: GateName_1: G$1; SymbolName_1: RESISTOR; LibraryName: sfe; DeviceSetName: RESISTOR

## Sheet sd-card.SchDoc
size A
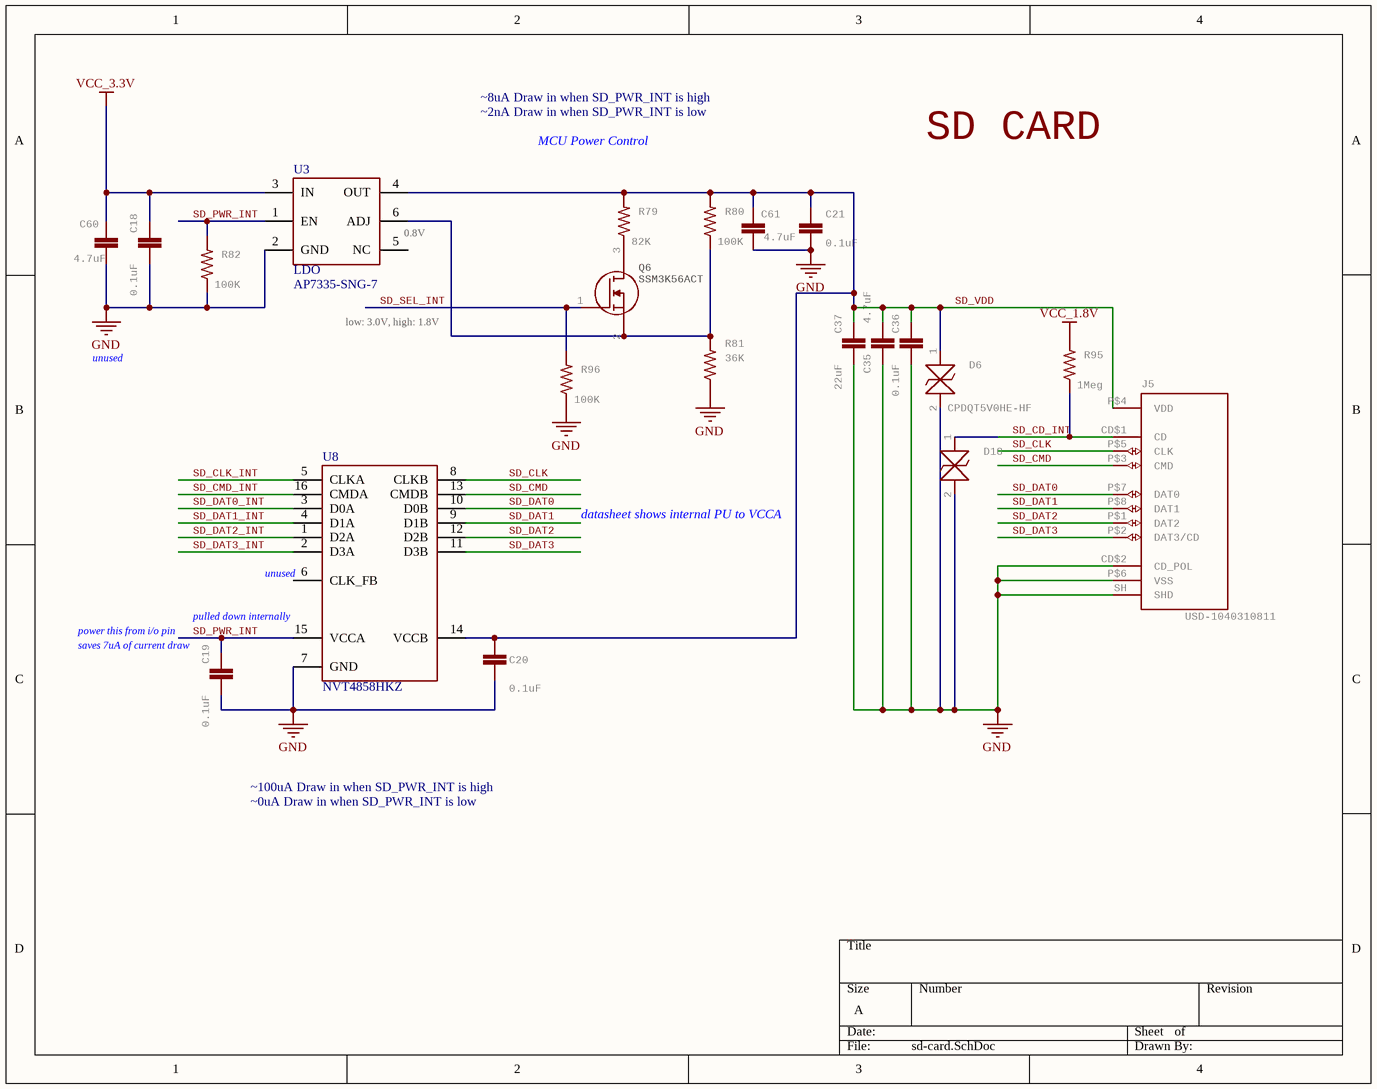
[diagram p7: sd-card.SchDoc]

### Parts
C18  0.1uF  [0402-CAP]
C19  0.1uF  [0402-CAP]
C20  0.1uF  [0402-CAP]
C21  0.1uF  [0402-CAP]
C35  4.7uF  [0402-CAP]
C36  0.1uF  [0402-CAP]
C37  22uF  [0805]
C60  4.7uF  [0402-CAP]
C61  4.7uF  [0402-CAP]
D6  CPDQT5V0HE-HF  [CPDQT5V0HEHF]
D18  CPDQT5V0HE-HF  [CPDQT5V0HEHF]  (value not drawn)
J5  USD-1040310811  [1040310811]
Q6  MPN: SSM3K56ACT  [DFN1006]  (hidden comment: NMOS)
R79  82K  [0402-RES]
R80  100K  [0402-RES]
R81  36K  [0402-RES]
R82  100K  [0402-RES]
R95  1Meg  [R0201]
R96  100K  [R0201]
U3  LDO  [DFN2020-6]
U8  NVT4858HKZ  [NVT4858HKZ]

### Nets
GND: C18.2 C19.2 C20.2 C21.2 C35.1 C36.2 C37.2 C60.2 C61.2 D6.2 D18.2 J5.CD$2(CD_POL) J5.P$6(VSS) J5.SH(SHD) R81.1 R82.1 R96.1 U3.2(GND) U8.7(GND)
VCC_1.8V: R95.2
VCC_3.3V: C18.1 C60.1 U3.3(IN)
SD_CD_INT: D18.1 J5.CD$1(CD) R95.1
SD_CLK: J5.P$5(CLK) U8.8(CLKB)
SD_CLK_INT: U8.5(CLKA)
SD_CMD: J5.P$3(CMD) U8.13(CMDB)
SD_CMD_INT: U8.16(CMDA)
SD_DAT0: J5.P$7(DAT0) U8.10(D0B)
SD_DAT0_INT: U8.3(D0A)
SD_DAT1: J5.P$8(DAT1) U8.9(D1B)
SD_DAT1_INT: U8.4(D1A)
SD_DAT2: J5.P$1(DAT2) U8.12(D2B)
SD_DAT2_INT: U8.1(D2A)
SD_DAT3: J5.P$2(DAT3/CD) U8.11(D3B)
SD_DAT3_INT: U8.2(D3A)
SD_PWR_INT: C19.1 R82.2 U3.1(EN) U8.15(VCCA)
SD_SEL_INT: Q6.1(G) R96.2
SD_VDD: C20.1 C21.1 C35.2 C36.1 C37.1 C61.1 D6.1 J5.P$4(VDD) R79.2 R80.2 U3.4(OUT) U8.14(VCCB)
NetQ6_2: Q6.2(S) R80.1 R81.2 U3.6(ADJ)
NetQ6_3: Q6.3(D) R79.1

Not connected (* = marked no-connect by the designer): U3 5(NC); U8 6(CLK_FB)

### Notes on the sheet
- ~8uA Draw in when SD_PWR_INT is high
- ~2nA Draw in when SD_PWR_INT is low
- MCU Power Control
- SD CARD
- (near U3) 0.8V
- unused
- low: 3.0V, high: 1.8V
- datasheet shows internal PU to VCCA
- (near U8) unused
- (near C19) power this from i/o pin
- (near C19) saves 7uA of current draw
- (near U8) pulled down internally
- ~0uA Draw in when SD_PWR_INT is low
- ~100uA Draw in when SD_PWR_INT is high

### Library data of the parts
C18-C21 C36 = C-EUC0201: as C28 on sheet usb; LibraryName: rcl; DeviceSetName: C-EU; SPICEPREFIX: C; Part Number: C0402C104Z4VAC
C35 C60 C61 = CAP0402-CAP: as C30 on sheet usb; DeviceName: 0402-CAP; LibraryName: sfe; DeviceSetName: CAP; Part Number: JMK105BBJ475MV-F
C37 = 22UF-0805-6.3V-20%: as C45 on sheet regulators; DeviceName: -0805-6.3V-20%; LibraryName: SparkFun-Capacitors; DeviceSetName: 22UF; Part Number: CL21A226MQQNNNE
D6 D18 = CPDQT5V0HE-HF: as D2 on sheet battery-charging; SymbolName_1: CPDQT5V0HE-HF; LibraryName: CPDQT5V0HE-HF; DeviceSetName: CPDQT5V0HE-HF; HEIGHT: 0.42mm; MANUFACTURER_PART_NUMBER: CPDQT5V0HE-HF; MOUSER_PART_NUMBER: MOUSER_PART_NUMBER; MOUSER_PRICE-STOCK: MOUSER_PRICE-STOCK; MPN: CPDQT5V0HE-HF; Part Number: CPDQT5V0HE-HF
J5 = USD-1040310811: uSD Slot; MPN: 104031-0811; GateName_1: G$1; SymbolName_1: USD; LibraryName: 1040310811; DeviceSetName: USD-1040310811; Part Number: 104031-0811
Q6 = NMOS: MF: Toshiba
R79 R81 R96 = RESISTOR0402-RES: as R5 on sheet ideal-diode; SymbolName_1: RESISTOR; LibraryName: sfe; DeviceSetName: RESISTOR
  R79 R81: DeviceName: 0402-RES
R80 R82 = RESISTOR0402-RES: as R29 on sheet prg-flash; SymbolName_1: RESISTOR; DeviceName: 0402-RES; LibraryName: sfe; DeviceSetName: RESISTOR; Part Number: AC0402FR-07100KL
R95 = RESISTOR0402-RES: GateName_1: G$1; SymbolName_1: RESISTOR; LibraryName: sfe; DeviceSetName: RESISTOR
U3 = AP7335-SNG-7: MF: Diodes Inc; MPN: AP7335-SNG-7
U8 = NVT4858HKZ: MF: NXP; MPN: NVT4858HKZ

## Sheet sensor-header.SchDoc
size B
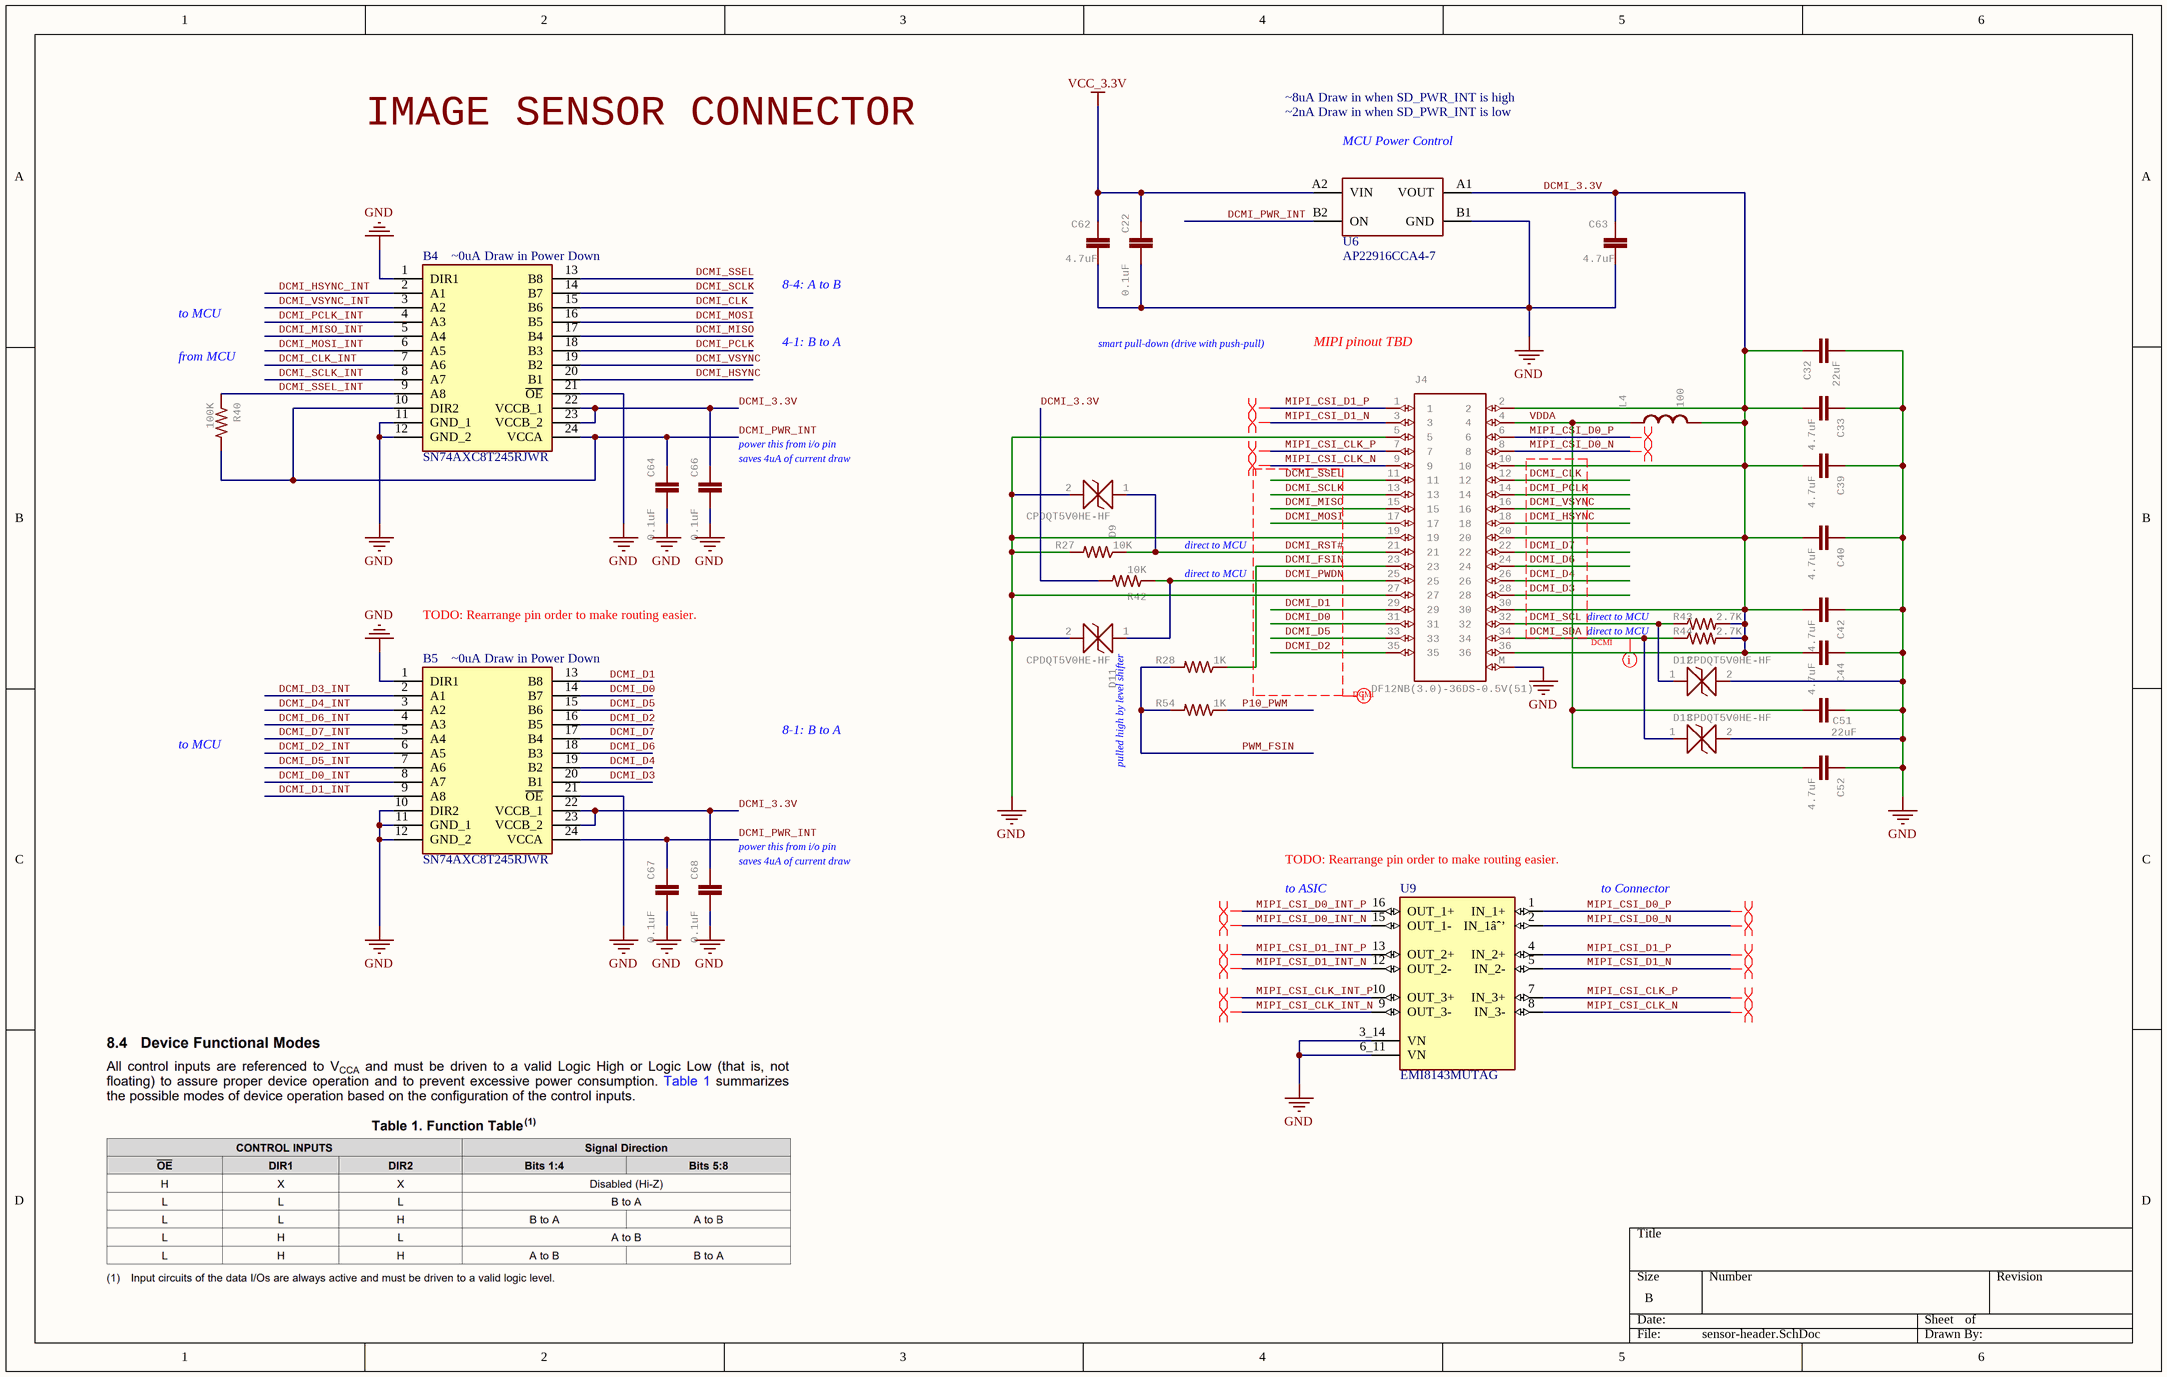
[diagram p8: sensor-header.SchDoc]

### Parts
B4  SN74AXC8T245RJWR  [SN74AXC8T245RJWR]
B5  SN74AXC8T245RJWR  [SN74AXC8T245RJWR]
C22  0.1uF  [0402-CAP]
C32  22uF  [0805]
C33  4.7uF  [0402-CAP]
C39  4.7uF  [0402-CAP]
C40  4.7uF  [0402-CAP]
C42  4.7uF  [0402-CAP]
C44  4.7uF  [0402-CAP]
C51  22uF  [0805]
C52  4.7uF  [0402-CAP]
C62  4.7uF  [0402-CAP]
C63  4.7uF  [0402-CAP]
C64  0.1uF  [0402-CAP]
C66  0.1uF  [0402-CAP]
C67  0.1uF  [0402-CAP]
C68  0.1uF  [0402-CAP]
D9  CPDQT5V0HE-HF  [CPDQT5V0HEHF]
D11  CPDQT5V0HE-HF  [CPDQT5V0HEHF]
D12  CPDQT5V0HE-HF  [CPDQT5V0HEHF]
D13  CPDQT5V0HE-HF  [CPDQT5V0HEHF]
J4  DF12NB(3.0)-36DS-0.5V(51)  [DF12-36-DS]
L4  100  [C0402]
R27  10K  [R0201]
R28  1K  [R0201]
R40  100K  [R0201]
R42  10K  [R0201]
R43  2.7K  [R0201]
R44  2.7K  [R0201]
R54  1K  [R0201]
U6  PMOS Load Switch  [AP22916CCA4-7]  (value not drawn)
U9  EMI8143MUTAG  [IC_EMI8143MUTAG]

### Nets
GND: B4.1(DIR1) B4.11(GND_1) B4.12(GND_2) B4.21(~{OE}) B5.1(DIR1) B5.10(DIR2) B5.11(GND_1) B5.12(GND_2) B5.21(~{OE}) C22.2 C32.2 C33.1 C39.1 C40.1 C42.1 C44.1 C51.2 C52.1 C62.2 C63.2 C64.2 C66.2 C67.2 C68.2 D9.2 D11.2 D12.2 D13.2 J4.5 J4.19 J4.27 J4.M R27.2 U6.B1(GND) U9.3_14(VN) U9.6_11(VN)
VCC_3.3V: C22.1 C62.1 U6.A2(VIN)
DCMI_3.3V: B4.22(VCCB_1) B4.23(VCCB_2) B5.22(VCCB_1) B5.23(VCCB_2) C32.1 C33.2 C39.2 C40.2 C42.2 C44.2 C63.1 C66.1 C68.1 J4.2 J4.10 J4.20 J4.30 J4.36 L4.2 R42.2 R43.2 R44.2 U6.A1(VOUT)
DCMI_CLK: B4.15(B6) J4.12
DCMI_CLK_INT: B4.7(A6)
DCMI_D0: B5.14(B7) J4.31
DCMI_D0_INT: B5.8(A7)
DCMI_D1: B5.13(B8) J4.29
DCMI_D1_INT: B5.9(A8)
DCMI_D2: B5.16(B5) J4.35
DCMI_D2_INT: B5.6(A5)
DCMI_D3: B5.20(B1) J4.28
DCMI_D3_INT: B5.2(A1)
DCMI_D4: B5.19(B2) J4.26
DCMI_D4_INT: B5.3(A2)
DCMI_D5: B5.15(B6) J4.33
DCMI_D5_INT: B5.7(A6)
DCMI_D6: B5.18(B3) J4.24
DCMI_D6_INT: B5.4(A3)
DCMI_D7: B5.17(B4) J4.22
DCMI_D7_INT: B5.5(A4)
DCMI_FSIN: J4.23 R28.1
DCMI_HSYNC: B4.20(B1) J4.18
DCMI_HSYNC_INT: B4.2(A1)
DCMI_MISO: B4.17(B4) J4.15
DCMI_MISO_INT: B4.5(A4)
DCMI_MOSI: B4.16(B5) J4.17
DCMI_MOSI_INT: B4.6(A5)
DCMI_PCLK: B4.18(B3) J4.14
DCMI_PCLK_INT: B4.4(A3)
DCMI_PWDN: D11.1 J4.25 R42.1
DCMI_PWR_INT: B4.10(DIR2) B4.24(VCCA) B5.24(VCCA) C64.1 C67.1 R40.2 U6.B2(ON)
DCMI_RST#: D9.1 J4.21 R27.1
DCMI_SCL: D12.1 J4.32 R43.1
DCMI_SCLK: B4.14(B7) J4.13
DCMI_SCLK_INT: B4.8(A7)
DCMI_SDA: D13.1 J4.34 R44.1
DCMI_SSEL: B4.13(B8) J4.11
DCMI_SSEL_INT: B4.9(A8) R40.1
DCMI_VSYNC: B4.19(B2) J4.16
DCMI_VSYNC_INT: B4.3(A2)
MIPI_CSI_CLK_INT_N: U9.9(OUT_3-)
MIPI_CSI_CLK_INT_P: U9.10(OUT_3+)
MIPI_CSI_CLK_N: J4.9 U9.8(IN_3-)
MIPI_CSI_CLK_P: J4.7 U9.7(IN_3+)
MIPI_CSI_D0_INT_N: U9.15(OUT_1-)
MIPI_CSI_D0_INT_P: U9.16(OUT_1+)
MIPI_CSI_D0_N: J4.8 U9.2(IN_1âˆ’)
MIPI_CSI_D0_P: J4.6 U9.1(IN_1+)
MIPI_CSI_D1_INT_N: U9.12(OUT_2-)
MIPI_CSI_D1_INT_P: U9.13(OUT_2+)
MIPI_CSI_D1_N: J4.3 U9.5(IN_2-)
MIPI_CSI_D1_P: J4.1 U9.4(IN_2+)
P10_PWM: R54.1
PWM_FSIN: R28.2 R54.2
VDDA: C51.1 C52.2 J4.4 L4.1

### Layout directives
net class DCMI: DCMI_D0, DCMI_D1, DCMI_D2, DCMI_D5, DCMI_FSIN, DCMI_MISO, DCMI_MOSI, DCMI_PWDN, DCMI_RST#, DCMI_SCLK, DCMI_SDA, DCMI_SSEL
differential pair; differential pair class MIPI: MIPI_CSI_CLK_INT_N, MIPI_CSI_CLK_INT_P, MIPI_CSI_CLK_N, MIPI_CSI_CLK_P, MIPI_CSI_D0_INT_N, MIPI_CSI_D0_INT_P, MIPI_CSI_D0_N, MIPI_CSI_D0_P, MIPI_CSI_D1_INT_N, MIPI_CSI_D1_INT_P, MIPI_CSI_D1_N, MIPI_CSI_D1_P

### Notes on the sheet
- ~8uA Draw in when SD_PWR_INT is high
- IMAGE SENSOR CONNECTOR
- ~2nA Draw in when SD_PWR_INT is low
- (near U6) MCU Power Control
- to MCU
- (near B4) ~0uA Draw in Power Down
- 8-4: A to B
- (near R40) from MCU
- 4-1: B to A
- smart pull-down (drive with push-pull)
- MIPI pinout TBD
- (near C66) power this from i/o pin
- (near C66) saves 4uA of current draw
- direct to MCU
- (near R42) direct to MCU
- TODO: Rearrange pin order to make routing easier.
- (near B5) ~0uA Draw in Power Down
- 8-1: B to A
- (near D11) pulled high by level shifter
- (near C68) power this from i/o pin
- (near C68) saves 4uA of current draw
- (near U9) TODO: Rearrange pin order to make routing easier.
- to ASIC
- to Connector

### Library data of the parts
B4 B5 = SN74AXC8T245RJWR: 8-Bit Dual-Supply Bus Transceiver; Manufacturer_Name: Texas Instruments; Geometry.Height: 0.55mm; Mouser Part Number: 595-SN74AXC8T245RJWR; Mouser Price/Stock: https://www.mouser.co.uk/ProductDetail/Texas-Instruments/SN74AXC8T245RJWR?qs=lc2O%252BfHJPVZ0xWM%2FSARpgw%3D%3D; Manufacturer_Part_Number: SN74AXC8T245RJWR; Datasheet Link: http://www.ti.com/lit/gpn/sn74axc8t245; MPN: SN74AXC8T245RJWR; Part Number: SN74AXC8T245RJWR
C22 C64 C66-C68 = C-EUC0201: as C28 on sheet usb; LibraryName: rcl; DeviceSetName: C-EU; SPICEPREFIX: C; Part Number: C0402C104Z4VAC
C32 C51 = 22UF-0805-6.3V-20%: as C45 on sheet regulators; DeviceName: -0805-6.3V-20%; LibraryName: SparkFun-Capacitors; DeviceSetName: 22UF; Part Number: CL21A226MQQNNNE
C33 C39 C40 C42 C44 C52 C62 C63 = CAP0402-CAP: as C30 on sheet usb; DeviceName: 0402-CAP; LibraryName: sfe; DeviceSetName: CAP; Part Number: JMK105BBJ475MV-F
D9 D11-D13 = CPDQT5V0HE-HF: as D2 on sheet battery-charging; SymbolName_1: CPDQT5V0HE-HF; LibraryName: CPDQT5V0HE-HF; DeviceSetName: CPDQT5V0HE-HF; HEIGHT: 0.42mm; MANUFACTURER_PART_NUMBER: CPDQT5V0HE-HF; MOUSER_PART_NUMBER: MOUSER_PART_NUMBER; MOUSER_PRICE-STOCK: MOUSER_PRICE-STOCK; MPN: CPDQT5V0HE-HF; Part Number: CPDQT5V0HE-HF
J4 = DF12-36-DS: Header; GateName_1: G$1; SymbolName_1: DF12-36; LibraryName: DF12-36-DS; DeviceSetName: DF12-36-DS; MPN: DF12NB(3.0)-36DS-0.5V(51); Part Number: DF12NB(3.0)-36DS-0.5V(51)
L4 = INDUCTOR0402: InductorsBasic Inductor/Choke - 0603 and 1206. Footprints are not proven and vary greatly between part numbers.; MPN: MFBM1V1005-101-R; GateName_1: G$1; DeviceName: 0402; SymbolName_1: INDUCTOR; LibraryName: sfe; DeviceSetName: INDUCTOR; Part Number: MFBM1V1005-101-R
R27 R28 R40 R42-R44 R54 = RESISTOR0402-RES: GateName_1: G$1; SymbolName_1: RESISTOR; LibraryName: sfe; DeviceSetName: RESISTOR
U6 = AP22916CCA4-7: MF: Diodes Inc; MPN: AP22916CCA4-7
U9 = CMP-008-000000-1: 6 Line Common Mode Choke Surface Mount 100mA DCR 6Ohm (Typ); MF: ON Semiconductor; Design Item ID: EMI8143MUTAG; Source: EMI8143MUTAG.SchLib; Package: XDFN-16 ON Semiconductor; Pin Count: 14; MP: EMI8143MUTAG; Component Type: Standard; Digi-Key_Part_Number: EMI8143MUTAGOSCT-ND; Value: *; SnapEDA_Link: https://www.snapeda.com/parts/EMI8143MUTAG/ON%20Semiconductor/view-part/182093/?ref=snap; Purchase-URL: https://pricing.snapeda.com/search/part/EMI8143MUTAG/?ref=eda; MPN: EMI8143MUTAG; Part Number: EMI8143MUTAG

## Sheet io-headers.SchDoc
size A
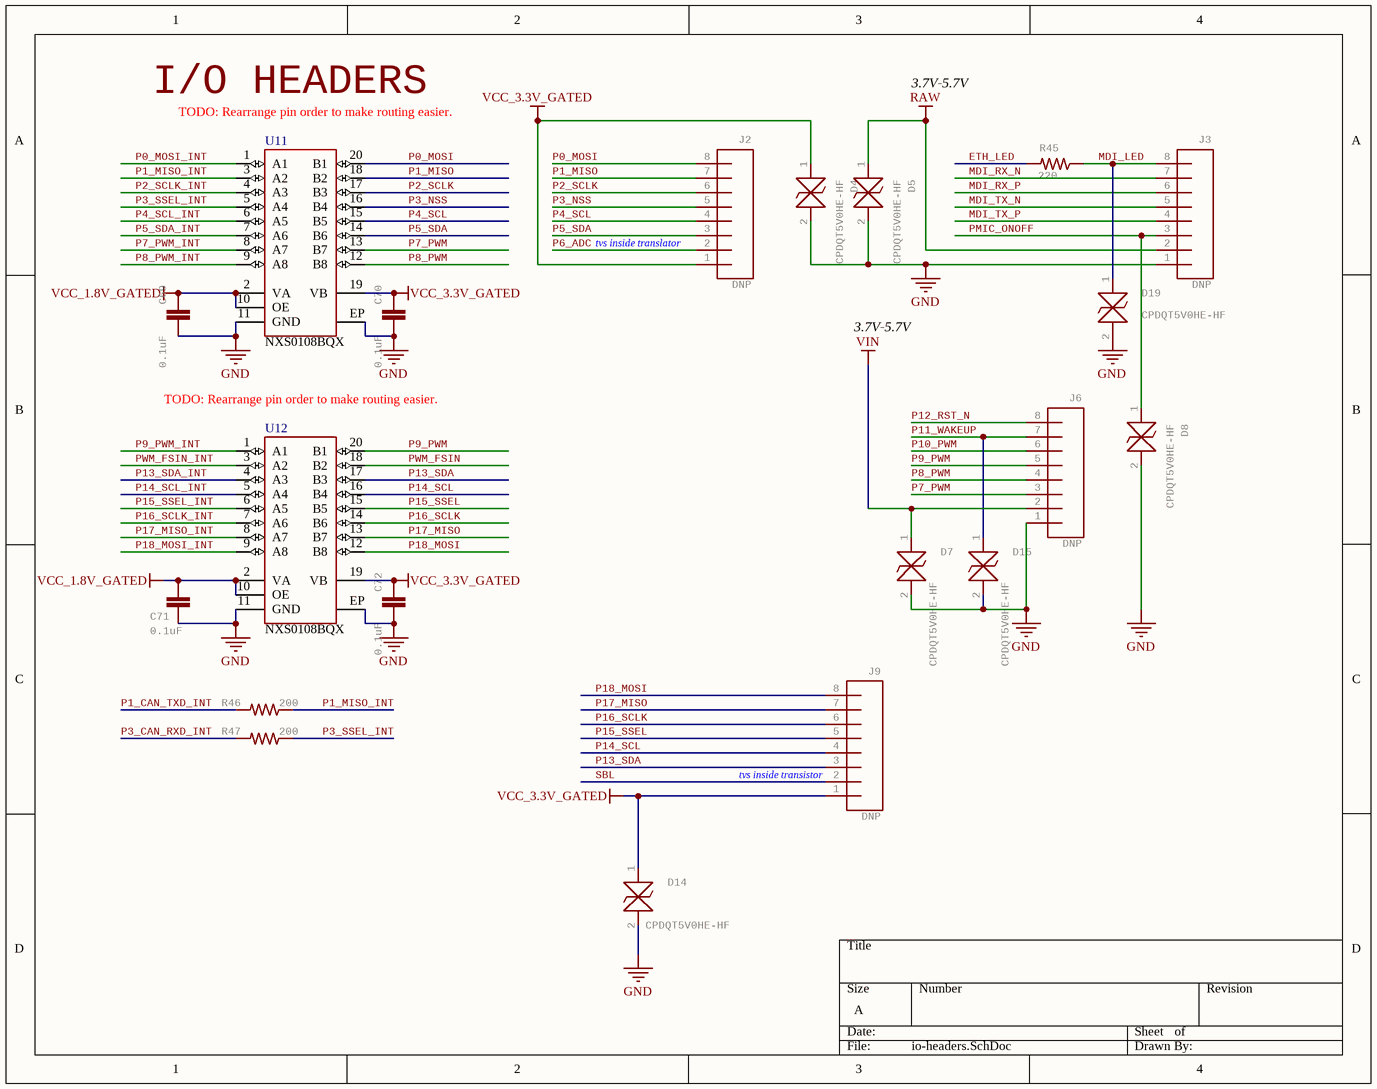
[diagram p9: io-headers.SchDoc]

### Parts
C69  0.1uF  [0402-CAP]
C70  0.1uF  [0402-CAP]
C71  0.1uF  [0402-CAP]
C72  0.1uF  [0402-CAP]
D4  CPDQT5V0HE-HF  [CPDQT5V0HEHF]
D5  CPDQT5V0HE-HF  [CPDQT5V0HEHF]
D7  CPDQT5V0HE-HF  [CPDQT5V0HEHF]
D8  CPDQT5V0HE-HF  [CPDQT5V0HEHF]
D14  CPDQT5V0HE-HF  [CPDQT5V0HEHF]
D15  CPDQT5V0HE-HF  [CPDQT5V0HEHF]
D19  CPDQT5V0HE-HF  [CPDQT5V0HEHF]
J2  DNP  [1X08]
J3  DNP  [1X08]
J6  DNP  [1X08]
J9  DNP  [1X08]
R45  220  [0402-RES]
R46  200  [0402-RES]
R47  200  [0402-RES]
U11  NXS0108BQX  [DHVQFN20_SOT764-1_NEX]
U12  NXS0108BQX  [DHVQFN20_SOT764-1_NEX]

### Nets
GND: C69.2 C70.2 C71.2 C72.2 D4.2 D5.2 D7.2 D8.2 D14.2 D15.2 D19.2 J3.1 J6.1 U11.11(GND) U11.EP(EPAD) U12.11(GND) U12.EP(EPAD)
RAW: D5.1 J3.2
VCC_1.8V_GATED: C69.1 C71.1 U11.2(VA) U11.10(OE) U12.2(VA) U12.10(OE)
VCC_3.3V_GATED: C70.1 C72.1 D4.1 D14.1 J2.1 J9.1 U11.19(VB) U12.19(VB)
VIN: D7.1 J6.2
ETH_LED: R45.2
MDI_LED: D19.1 J3.8 R45.1
MDI_RX_N: J3.7
MDI_RX_P: J3.6
MDI_TX_N: J3.5
MDI_TX_P: J3.4
P0_MOSI: J2.8 U11.20(B1)
P0_MOSI_INT: U11.1(A1)
P1_CAN_TXD_INT: R46.2
P1_MISO: J2.7 U11.18(B2)
P1_MISO_INT: R46.1 U11.3(A2)
P2_SCLK: J2.6 U11.17(B3)
P2_SCLK_INT: U11.4(A3)
P3_CAN_RXD_INT: R47.2
P3_NSS: J2.5 U11.16(B4)
P3_SSEL_INT: R47.1 U11.5(A4)
P4_SCL: J2.4 U11.15(B5)
P4_SCL_INT: U11.6(A5)
P5_SDA: J2.3 U11.14(B6)
P5_SDA_INT: U11.7(A6)
P6_ADC: J2.2
P7_PWM: J6.3 U11.13(B7)
P7_PWM_INT: U11.8(A7)
P8_PWM: J6.4 U11.12(B8)
P8_PWM_INT: U11.9(A8)
P9_PWM: J6.5 U12.20(B1)
P9_PWM_INT: U12.1(A1)
P10_PWM: J6.6
P11_WAKEUP: D15.1 J6.7
P12_RST_N: J6.8
P13_SDA: J9.3 U12.17(B3)
P13_SDA_INT: U12.4(A3)
P14_SCL: J9.4 U12.16(B4)
P14_SCL_INT: U12.5(A4)
P15_SSEL: J9.5 U12.15(B5)
P15_SSEL_INT: U12.6(A5)
P16_SCLK: J9.6 U12.14(B6)
P16_SCLK_INT: U12.7(A6)
P17_MISO: J9.7 U12.13(B7)
P17_MISO_INT: U12.8(A7)
P18_MOSI: J9.8 U12.12(B8)
P18_MOSI_INT: U12.9(A8)
PMIC_ONOFF: D8.1 J3.3
PWM_FSIN: U12.18(B2)
PWM_FSIN_INT: U12.3(A2)
SBL: J9.2

### Notes on the sheet
- I/O HEADERS
- 3.7V-5.7V
- (near U11) TODO: Rearrange pin order to make routing easier.
- (near J2) tvs inside translator
- (near U12) TODO: Rearrange pin order to make routing easier.
- (near J9) tvs inside transistor

### Library data of the parts
C69-C72 = C-EUC0201: as C28 on sheet usb; LibraryName: rcl; DeviceSetName: C-EU; SPICEPREFIX: C; Part Number: C0402C104Z4VAC
D4 D5 D7 D8 D14 D15 D19 = CPDQT5V0HE-HF: as D2 on sheet battery-charging; SymbolName_1: CPDQT5V0HE-HF; LibraryName: CPDQT5V0HE-HF; DeviceSetName: CPDQT5V0HE-HF; HEIGHT: 0.42mm; MANUFACTURER_PART_NUMBER: CPDQT5V0HE-HF; MOUSER_PART_NUMBER: MOUSER_PART_NUMBER; MOUSER_PRICE-STOCK: MOUSER_PRICE-STOCK; MPN: CPDQT5V0HE-HF; Part Number: CPDQT5V0HE-HF
J2 J3 J6 J9 = CONN_08": Multi connection point. Often used as Generic Header-pin footprint for 0.1 inch spaced/style header connections    On any of the 0.1 inch spaced packages, you can populate with these:  Break Away Headers - Straight (PRT-00116)   Break Away Male Headers - Right Angle (PRT-00553)   Female Headers (PRT-00115)   Break Away Headers - Machine Pin (PRT-00117)   Break Away Female Headers - Swiss Machine Pin (PRT-00743)   Arduino Stackable Header - 8 Pin (PRT-09279)        For SCREWTERMINALS and SPRING TERMINALS visit here:  Screw Terimnals on SparkFun.com (5mm/3.5mm/2.54mm spacing)       This device is also useful as a general connection point to wire up your design to another part of your project. Our various solder wires solder well into these plated through hole pads.  Hook-Up Wire - Assortment (Stranded, 22 AWG) (PRT-11375)   Hook-Up Wire - Assortment (Solid Core, 22 AWG) (PRT-11367)   View the entire wire category on our website here          Special notes:     Molex polarized connector foot print use with SKU : PRT-08231 with associated crimp pins and housings. 1MM SMD Version SKU: PRT-10208    NOTES ON THE VARIANTS LOCK and LOCK_LONGPADS... This footprint was designed to help hold the alignment of a through-hole component (i.e.  6-pin header) while soldering it into place. You may notice that each hole has been shifted either up or down by 0.005 of an inch from it's more standard position (which is a perfectly straight line).  This slight alteration caused the pins (the squares in the middle) to touch the edges of the holes.  Because they are alternating, it causes a "brace" to hold the component in place.  0.005 has proven to be the perfect amount of "off-center" position when using our standard breakaway headers. Although looks a little odd when you look at the bare footprint, once you have a header in there, the alteration is very hard to notice.  Also,if you push a header all the way into place, it is covered up entirely on the bottom side.; GateName_1: G$1; DeviceName: "; POPULATE: 0; PROD_ID: CONN-08438; SymbolName_1: CONN_08; LibraryName: SparkFun-Connectors; DeviceSetName: CONN_08; MPN: DNP; Part Number: DNP
R45 = RESISTOR0402-RES: ResistorBasic schematic elements and footprints for 0603, 1206, and PTH resistors.; MPN: CRGCQ0402F220R; GateName_1: G$1; SymbolName_1: RESISTOR; DeviceName: 0402-RES; LibraryName: sfe; DeviceSetName: RESISTOR; Part Number: CRGCQ0402F220R
R46 R47 = RESISTOR0402-RES: ResistorBasic schematic elements and footprints for 0603, 1206, and PTH resistors.; MPN: AC0402JR-07200RL; GateName_1: G$1; SymbolName_1: RESISTOR; DeviceName: 0402-RES; LibraryName: sfe; DeviceSetName: RESISTOR; Part Number: AC0402JR-07200RL
U11 U12 = NXS0108BQX: No Description Available; MF: Nexperia; Part Number: NXS0108BQX; MPN: NXS0108BQX

## Sheet jtag.SchDoc
size A
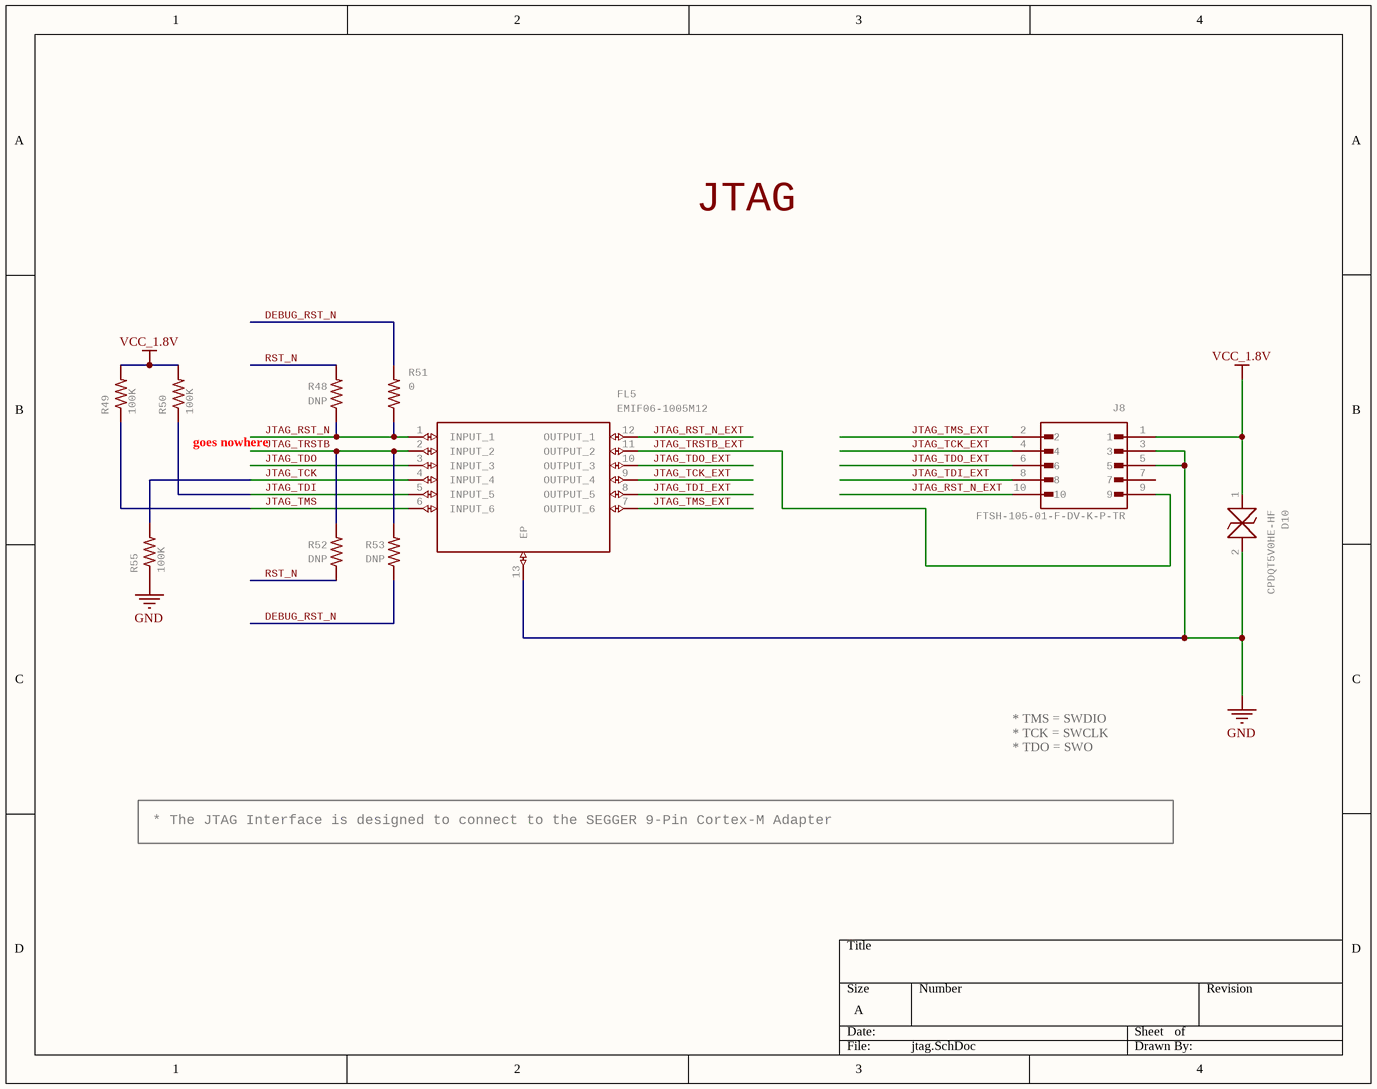
[diagram p10: jtag.SchDoc]

### Parts
D10  CPDQT5V0HE-HF  [CPDQT5V0HEHF]
FL5  EMIF06-1005M12  [SON40P150X250X65-13N]
J8  FTSH-105-01-F-DV-K-P-TR  [CNC_3221-10-0300-00]
R48  DNP  [0402-RES]
R49  100K  [R0201]
R50  100K  [R0201]
R51  0  [0402-RES]
R52  DNP  [0402-RES]
R53  DNP  [0402-RES]
R55  100K  [R0201]

### Nets
GND: D10.2 FL5.13(EP) J8.3 J8.5 R55.1
VCC_1.8V: D10.1 J8.1 R49.2 R50.2
DEBUG_RST_N: R51.2 R53.1
JTAG_RST_N: FL5.1(INPUT_1) R48.1 R51.1
JTAG_RST_N_EXT: FL5.12(OUTPUT_1) J8.10
JTAG_TCK: FL5.4(INPUT_4) R55.2
JTAG_TCK_EXT: FL5.9(OUTPUT_4) J8.4
JTAG_TDI: FL5.5(INPUT_5) R50.1
JTAG_TDI_EXT: FL5.8(OUTPUT_5) J8.8
JTAG_TDO: FL5.3(INPUT_3)
JTAG_TDO_EXT: FL5.10(OUTPUT_3) J8.6
JTAG_TMS: FL5.6(INPUT_6) R49.1
JTAG_TMS_EXT: FL5.7(OUTPUT_6) J8.2
JTAG_TRSTB: FL5.2(INPUT_2) R52.2 R53.2
JTAG_TRSTB_EXT: FL5.11(OUTPUT_2) J8.9
RST_N: R48.2 R52.1

Not connected (* = marked no-connect by the designer): J8 7

### Notes on the sheet
- JTAG
- (near R50) goes nowhere
- * The JTAG Interface is designed to connect to the SEGGER 9-Pin Cortex-M Adapter
- * TMS = SWDIO
  * TCK = SWCLK
  * TDO = SWO

### Library data of the parts
D10 = CPDQT5V0HE-HF: as D2 on sheet battery-charging; SymbolName_1: CPDQT5V0HE-HF; LibraryName: CPDQT5V0HE-HF; DeviceSetName: CPDQT5V0HE-HF; HEIGHT: 0.42mm; MANUFACTURER_PART_NUMBER: CPDQT5V0HE-HF; MOUSER_PART_NUMBER: MOUSER_PART_NUMBER; MOUSER_PRICE-STOCK: MOUSER_PRICE-STOCK; MPN: CPDQT5V0HE-HF; Part Number: CPDQT5V0HE-HF
FL5 = EMIF06-1005M12: EMI Filter Circuits 6lin lw cpcitnc EMI 45pF -35db @ 900MHz   Source:  Datasheet; MANUFACTURER_NAME: STMicroelectronics; GateName_1: G$1; SymbolName_1: EMIF06-1005M12; LibraryName: EMIF06-1005M12; DeviceSetName: EMIF06-1005M12; HEIGHT: 0.65mm; MANUFACTURER_PART_NUMBER: EMIF06-1005M12; MOUSER_PART_NUMBER: 511-EMIF06-1005M12; MOUSER_PRICE-STOCK: https://www.mouser.co.uk/ProductDetail/STMicroelectronics/EMIF06-1005M12?qs=VJaATVMq%252BXo0u09ZqtQg3A%3D%3D; MPN: EMIF06-1005M12; Part Number: EMIF06-1005M12
J8 = 3221-10-0300-00: Check availability; GateName_1: G$1; MF: CNC Tech; SymbolName_1: 3221-10-0300-00; LibraryName: 3221-10-0300-00; DeviceSetName: 3221-10-0300-00; AVAILABILITY: In Stock; MP: FTSH-105-01-F-DV-K-P-TR; MPN: FTSH-105-01-F-DV-K-P-TR; PACKAGE: None; PRICE: None; PURCHASE-URL: https://pricing.snapeda.com/search/part/3221-10-0300-00/?ref=eda; Part Number: FTSH-105-01-F-DV-K-P-TR
R48 R52 R53 = RESISTOR0402-RES: as R5 on sheet ideal-diode; SymbolName_1: RESISTOR; DeviceName: 0402-RES; LibraryName: sfe; DeviceSetName: RESISTOR
R49 R50 R55 = RESISTOR0402-RES: GateName_1: G$1; SymbolName_1: RESISTOR; LibraryName: sfe; DeviceSetName: RESISTOR
R51 = RESISTOR0402-RES: as R33 on sheet prg-flash; SymbolName_1: RESISTOR; DeviceName: 0402-RES; LibraryName: sfe; DeviceSetName: RESISTOR; Part Number: RC0402JR-070R

## Sheet display-header.SchDoc
size A
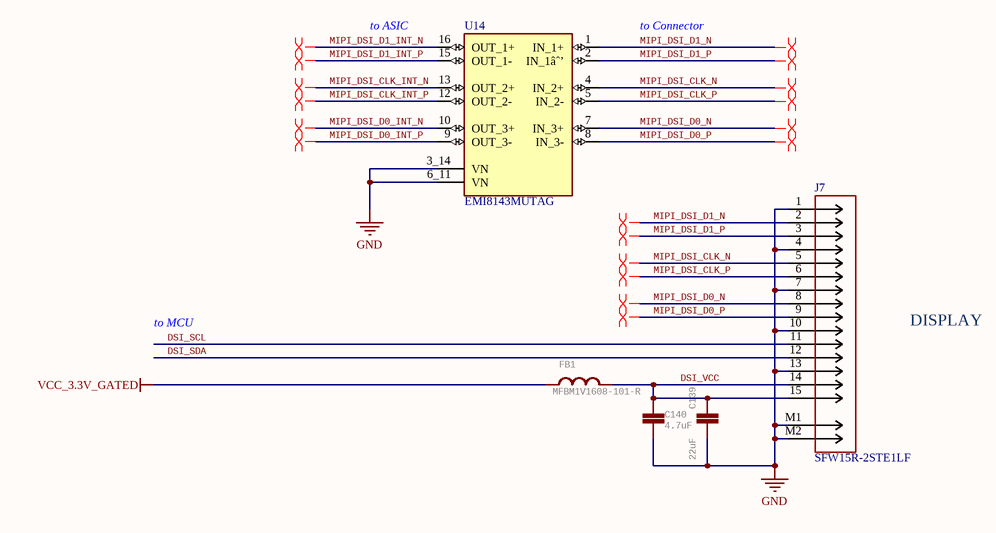
[diagram p11: display-header.SchDoc]

### Parts
C139  22uF  [0805]
C140  4.7uF  [0402-CAP]
FB1  MFBM1V1608-101-R  [0603-RES]
J7  SFW15R-2STE1LF  [CON15_1X15_DRB_SFW_JAE]
U14  EMI8143MUTAG  [IC_EMI8143MUTAG]

### Nets
GND: C139.2 C140.1 J7.1 J7.4 J7.7 J7.10 J7.13 J7.M1 J7.M2 U14.3_14(VN) U14.6_11(VN)
VCC_3.3V_GATED: FB1.1
DSI_SCL: J7.11
DSI_SDA: J7.12
DSI_VCC: C139.1 C140.2 FB1.2 J7.14 J7.15
MIPI_DSI_CLK_INT_N: U14.13(OUT_2+)
MIPI_DSI_CLK_INT_P: U14.12(OUT_2-)
MIPI_DSI_CLK_N: J7.5 U14.4(IN_2+)
MIPI_DSI_CLK_P: J7.6 U14.5(IN_2-)
MIPI_DSI_D0_INT_N: U14.10(OUT_3+)
MIPI_DSI_D0_INT_P: U14.9(OUT_3-)
MIPI_DSI_D0_N: J7.8 U14.7(IN_3+)
MIPI_DSI_D0_P: J7.9 U14.8(IN_3-)
MIPI_DSI_D1_INT_N: U14.16(OUT_1+)
MIPI_DSI_D1_INT_P: U14.15(OUT_1-)
MIPI_DSI_D1_N: J7.2 U14.1(IN_1+)
MIPI_DSI_D1_P: J7.3 U14.2(IN_1âˆ’)

### Layout directives
differential pair; differential pair class MIPI: MIPI_DSI_CLK_INT_N, MIPI_DSI_CLK_INT_P, MIPI_DSI_CLK_N, MIPI_DSI_CLK_P, MIPI_DSI_D0_INT_N, MIPI_DSI_D0_INT_P, MIPI_DSI_D0_N, MIPI_DSI_D0_P, MIPI_DSI_D1_INT_N, MIPI_DSI_D1_INT_P, MIPI_DSI_D1_N, MIPI_DSI_D1_P

### Notes on the sheet
- (near U14) to ASIC
- to Connector
- to MCU
- DISPLAY

### Library data of the parts
C139 = 22UF-0805-6.3V-20%: as C45 on sheet regulators; DeviceName: -0805-6.3V-20%; LibraryName: SparkFun-Capacitors; DeviceSetName: 22UF; Part Number: CL21A226MQQNNNE
C140 = CAP0402-CAP: as C30 on sheet usb; DeviceName: 0402-CAP; LibraryName: sfe; DeviceSetName: CAP; Part Number: JMK105BBJ475MV-F
FB1 = INDUCTOR: as L1 on sheet usb; MPN: MFBM1V1608-101-R; Part Number: MFBM1V1608-101-R
J7 = SFW15R-2STE1LF: No Description Available; MF: JAE Electronics; Copyright: Copyright (C) 2023 Ultra Librarian. All rights reserved.; MPN: SFW15R-2STE1LF; Part Number: SFW15R-2STE1LF
U14 = CMP-008-000000-1: as U9 on sheet sensor-header; Design Item ID: EMI8143MUTAG; Source: EMI8143MUTAG.SchLib; Package: XDFN-16 ON Semiconductor; Pin Count: 14; MP: EMI8143MUTAG; Component Type: Standard; Digi-Key_Part_Number: EMI8143MUTAGOSCT-ND; Value: *; SnapEDA_Link: https://www.snapeda.com/parts/EMI8143MUTAG/ON%20Semiconductor/view-part/182093/?ref=snap; Purchase-URL: https://pricing.snapeda.com/search/part/EMI8143MUTAG/?ref=eda; MPN: EMI8143MUTAG; Part Number: EMI8143MUTAG

## Sheet ethernet.SchDoc
size A
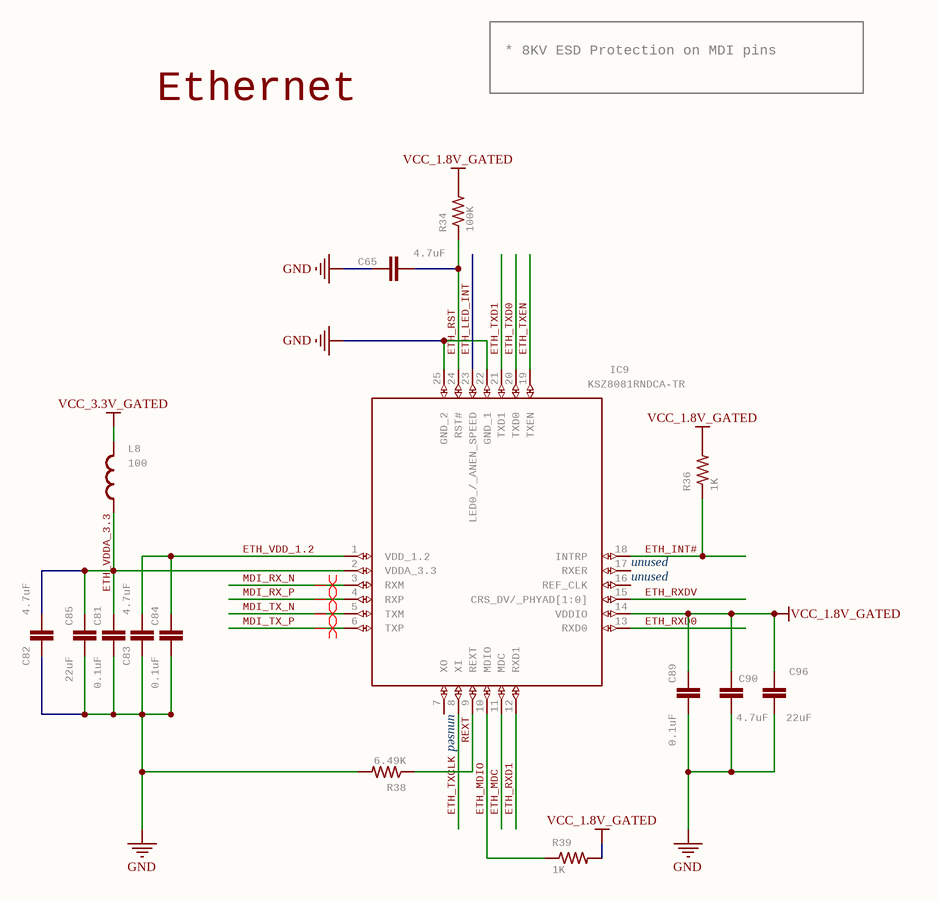
[diagram p12: ethernet.SchDoc]

### Parts
C65  4.7uF  [0402-CAP]
C81  0.1uF  [0402-CAP]
C82  4.7uF  [0402-CAP]
C83  4.7uF  [0402-CAP]
C84  0.1uF  [0402-CAP]
C85  22uF  [0805]
C89  0.1uF  [0402-CAP]
C90  4.7uF  [0402-CAP]
C96  22uF  [0805]
IC9  KSZ8081RNDCA-TR  [QFN50P400X400X90-25N]
L8  100  [C0402]
R34  100K  [0402-RES]
R36  1K  [0402-RES]
R38  6.49K  [0402-RES]
R39  1K  [0402-RES]

### Nets
GND: C65.1 C81.2 C82.1 C83.1 C84.2 C85.2 C89.2 C90.1 C96.2 IC9.22(GND_1) IC9.25(GND_2) R38.2
VCC_1.8V_GATED: C89.1 C90.2 C96.1 IC9.14(VDDIO) R34.2 R36.2 R39.2
VCC_3.3V_GATED: L8.2
ETH_INT#: IC9.18(INTRP) R36.1
ETH_LED_INT: IC9.23(LED0_/_ANEN_SPEED)
ETH_MDC: IC9.11(MDC)
ETH_MDIO: IC9.10(MDIO) R39.1
ETH_RST: C65.2 IC9.24(RST#) R34.1
ETH_RXD0: IC9.13(RXD0)
ETH_RXD1: IC9.12(RXD1)
ETH_RXDV: IC9.15(CRS_DV/_PHYAD[1:0])
ETH_TXCLK: IC9.8(XI)
ETH_TXD0: IC9.20(TXD0)
ETH_TXD1: IC9.21(TXD1)
ETH_TXEN: IC9.19(TXEN)
ETH_VDD_1.2: C83.2 C84.1 IC9.1(VDD_1.2)
ETH_VDDA_3.3: C81.1 C82.2 C85.1 IC9.2(VDDA_3.3) L8.1
MDI_RX_N: IC9.3(RXM)
MDI_RX_P: IC9.4(RXP)
MDI_TX_N: IC9.5(TXM)
MDI_TX_P: IC9.6(TXP)
REXT: IC9.9(REXT) R38.1

Not connected (* = marked no-connect by the designer): IC9 7(XO) 16(REF_CLK) 17(RXER)

### Layout directives
differential pair: MDI_RX_N, MDI_RX_P, MDI_TX_N, MDI_TX_P

### Notes on the sheet
- Ethernet
- * 8KV ESD Protection on MDI pins
- (near IC9) unused
- unused

### Library data of the parts
C65 C82 C83 C90 = CAP0402-CAP: as C30 on sheet usb; DeviceName: 0402-CAP; LibraryName: sfe; DeviceSetName: CAP; Part Number: JMK105BBJ475MV-F
C81 C84 C89 = C-EUC0201: as C28 on sheet usb; LibraryName: rcl; DeviceSetName: C-EU; SPICEPREFIX: C; Part Number: C0402C104Z4VAC
C85 C96 = 22UF-0805-6.3V-20%: as C45 on sheet regulators; DeviceName: -0805-6.3V-20%; LibraryName: SparkFun-Capacitors; DeviceSetName: 22UF; Part Number: CL21A226MQQNNNE
IC9 = KSZ8081RNDCA-TR: Ethernet ICs 10/100 BASE-TX Physical Layer Transceiver   Source:  Datasheet; MANUFACTURER_NAME: Microchip; GateName_1: G$1; SymbolName_1: KSZ8081RNDCA-TR; LibraryName: KSZ8081RNDCA-TR; DeviceSetName: KSZ8081RNDCA-TR; HEIGHT: 0.9mm; MANUFACTURER_PART_NUMBER: KSZ8081RNDCA-TR; MOUSER_PART_NUMBER: 998-KSZ8081RNDCATR; MOUSER_PRICE-STOCK: https://www.mouser.co.uk/ProductDetail/Microchip-Technology-Atmel/KSZ8081RNDCA-TR?qs=U6T8BxXiZAXLXXdn%2FieQKw%3D%3D; MPN: KSZ8081RNDCA-TR; Part Number: KSZ8081RNDCA-TR
L8 = INDUCTOR0402: as L4 on sheet sensor-header; SymbolName_1: INDUCTOR; LibraryName: sfe; DeviceSetName: INDUCTOR; Part Number: MFBM1V1005-101-R
R34 = RESISTOR0402-RES: as R29 on sheet prg-flash; SymbolName_1: RESISTOR; DeviceName: 0402-RES; LibraryName: sfe; DeviceSetName: RESISTOR; Part Number: AC0402FR-07100KL
R36 R39 = RESISTOR0402-RES: ResistorBasic schematic elements and footprints for 0603, 1206, and PTH resistors.; MPN: CRCW04021K00FKEDC; GateName_1: G$1; SymbolName_1: RESISTOR; DeviceName: 0402-RES; LibraryName: sfe; DeviceSetName: RESISTOR; Part Number: CRCW04021K00FKEDC
R38 = RESISTOR0402-RES: ResistorBasic schematic elements and footprints for 0603, 1206, and PTH resistors.; MPN: CR0402-FX-6491GLF; GateName_1: G$1; SymbolName_1: RESISTOR; DeviceName: 0402-RES; LibraryName: sfe; DeviceSetName: RESISTOR; Part Number: CR0402-FX-6491GLF